# EAGLE design Artemis2 (EAGLE 5.07)
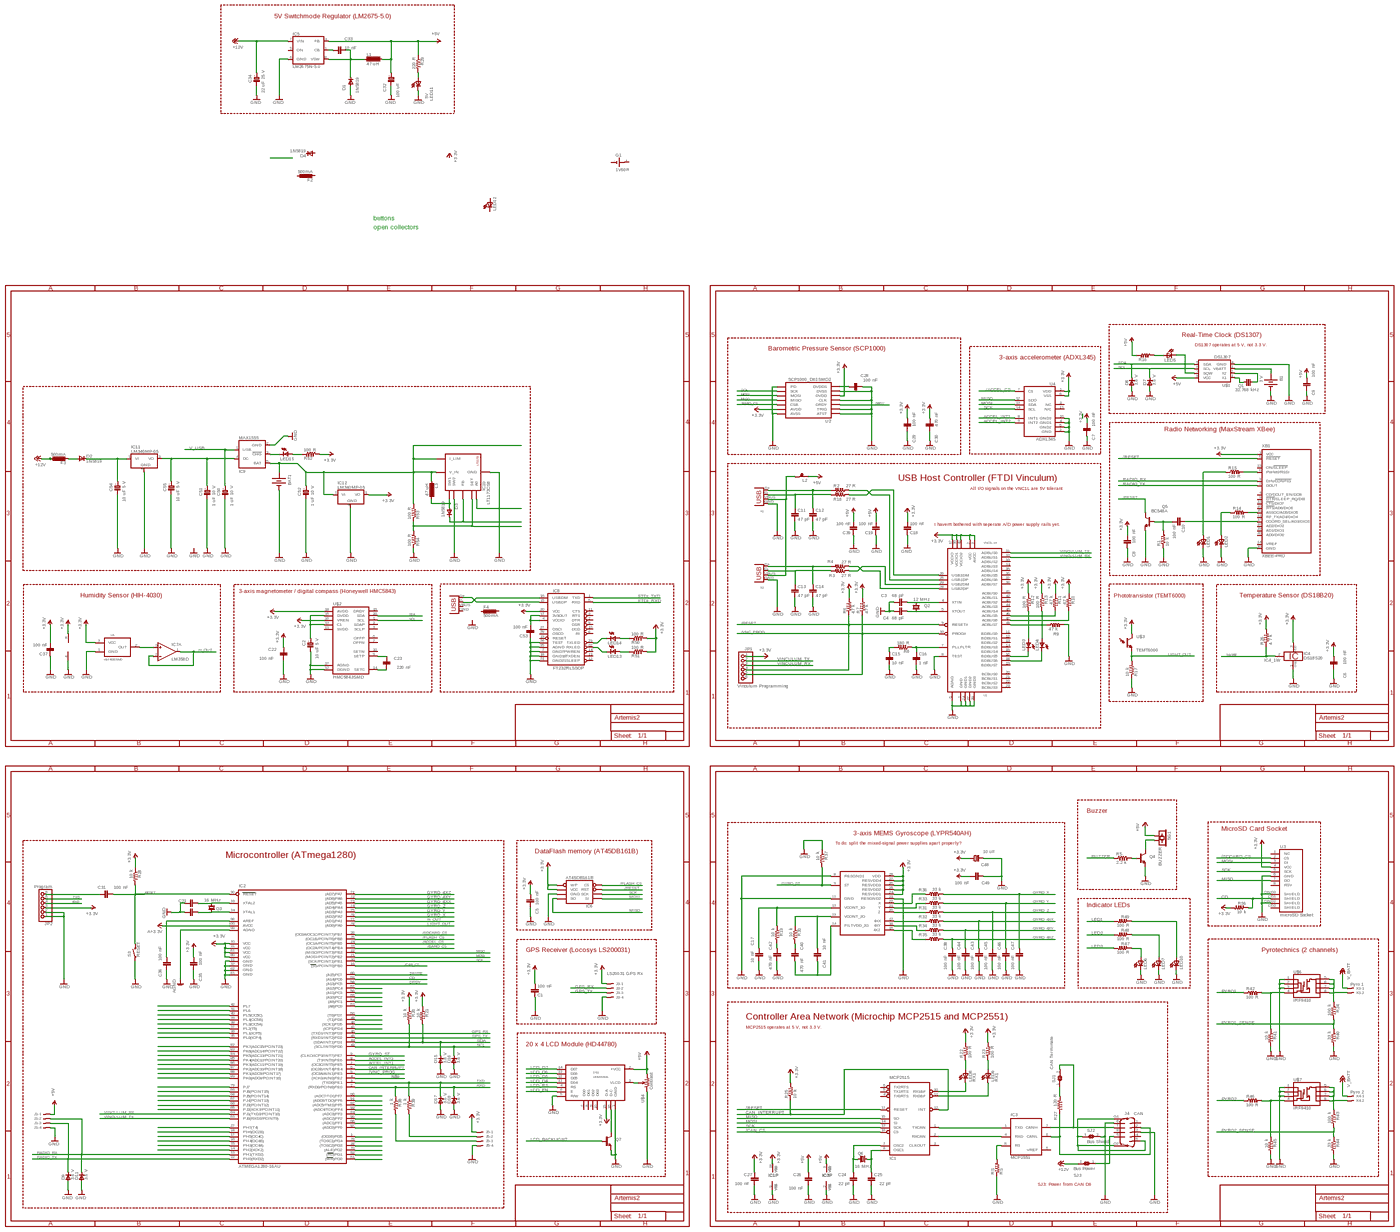
[diagram p0: schematic, sheet 1, overview]
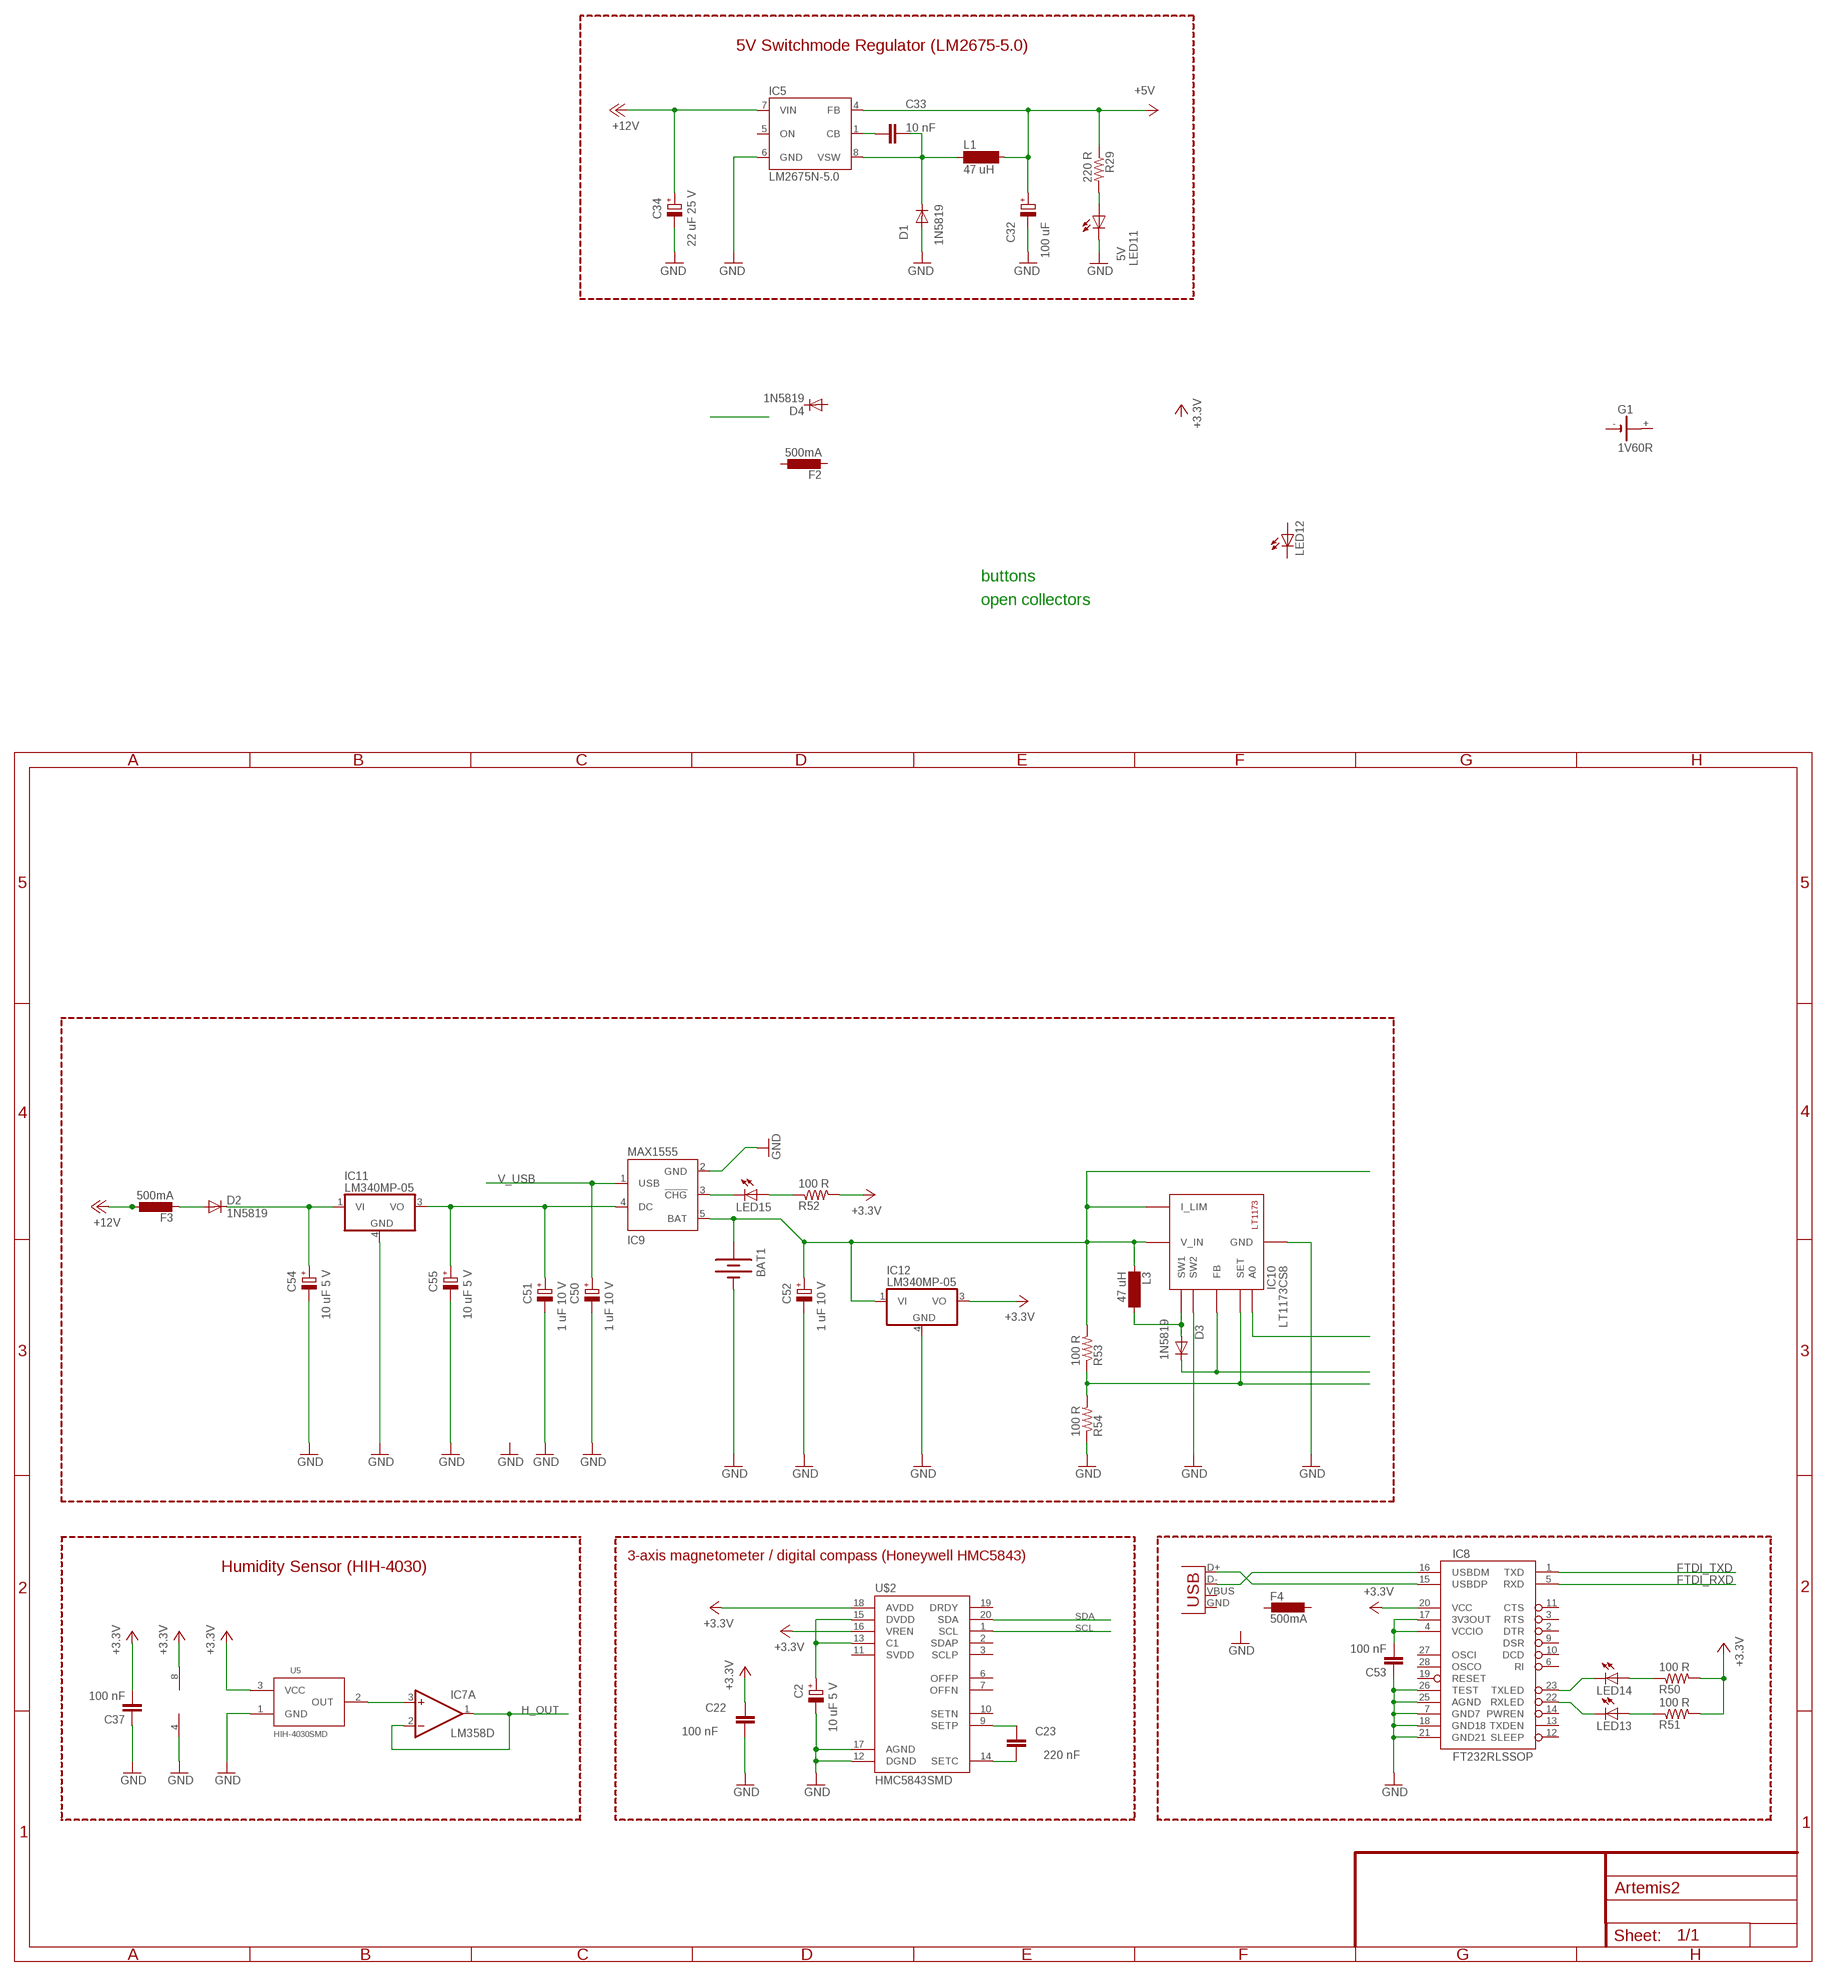
[diagram p1: schematic, sheet 1, part 1 of 4]
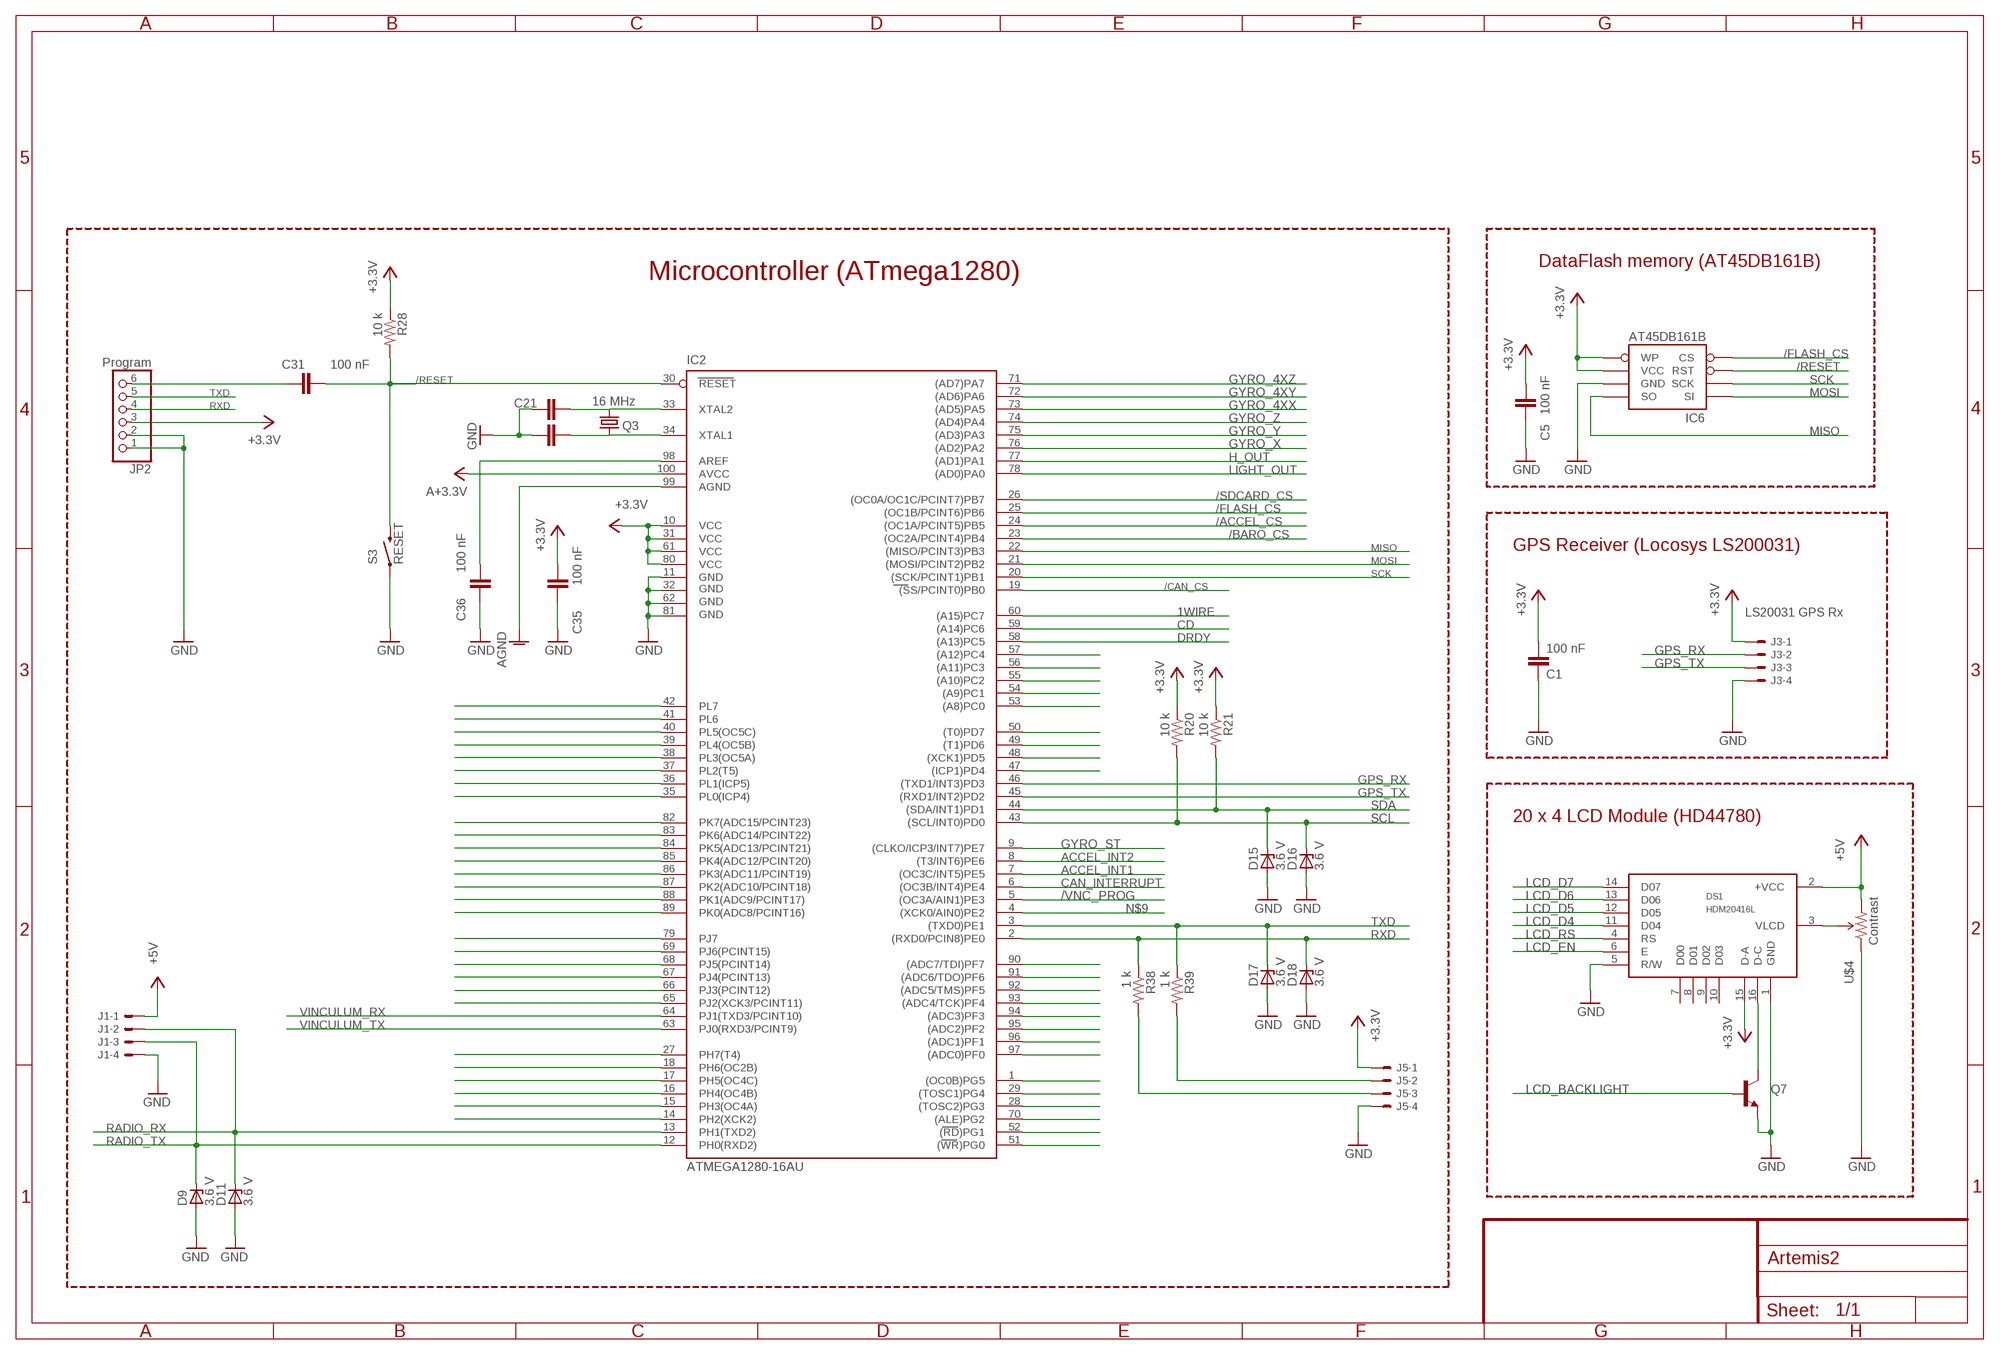
[diagram p2: schematic, sheet 1, part 2 of 4]
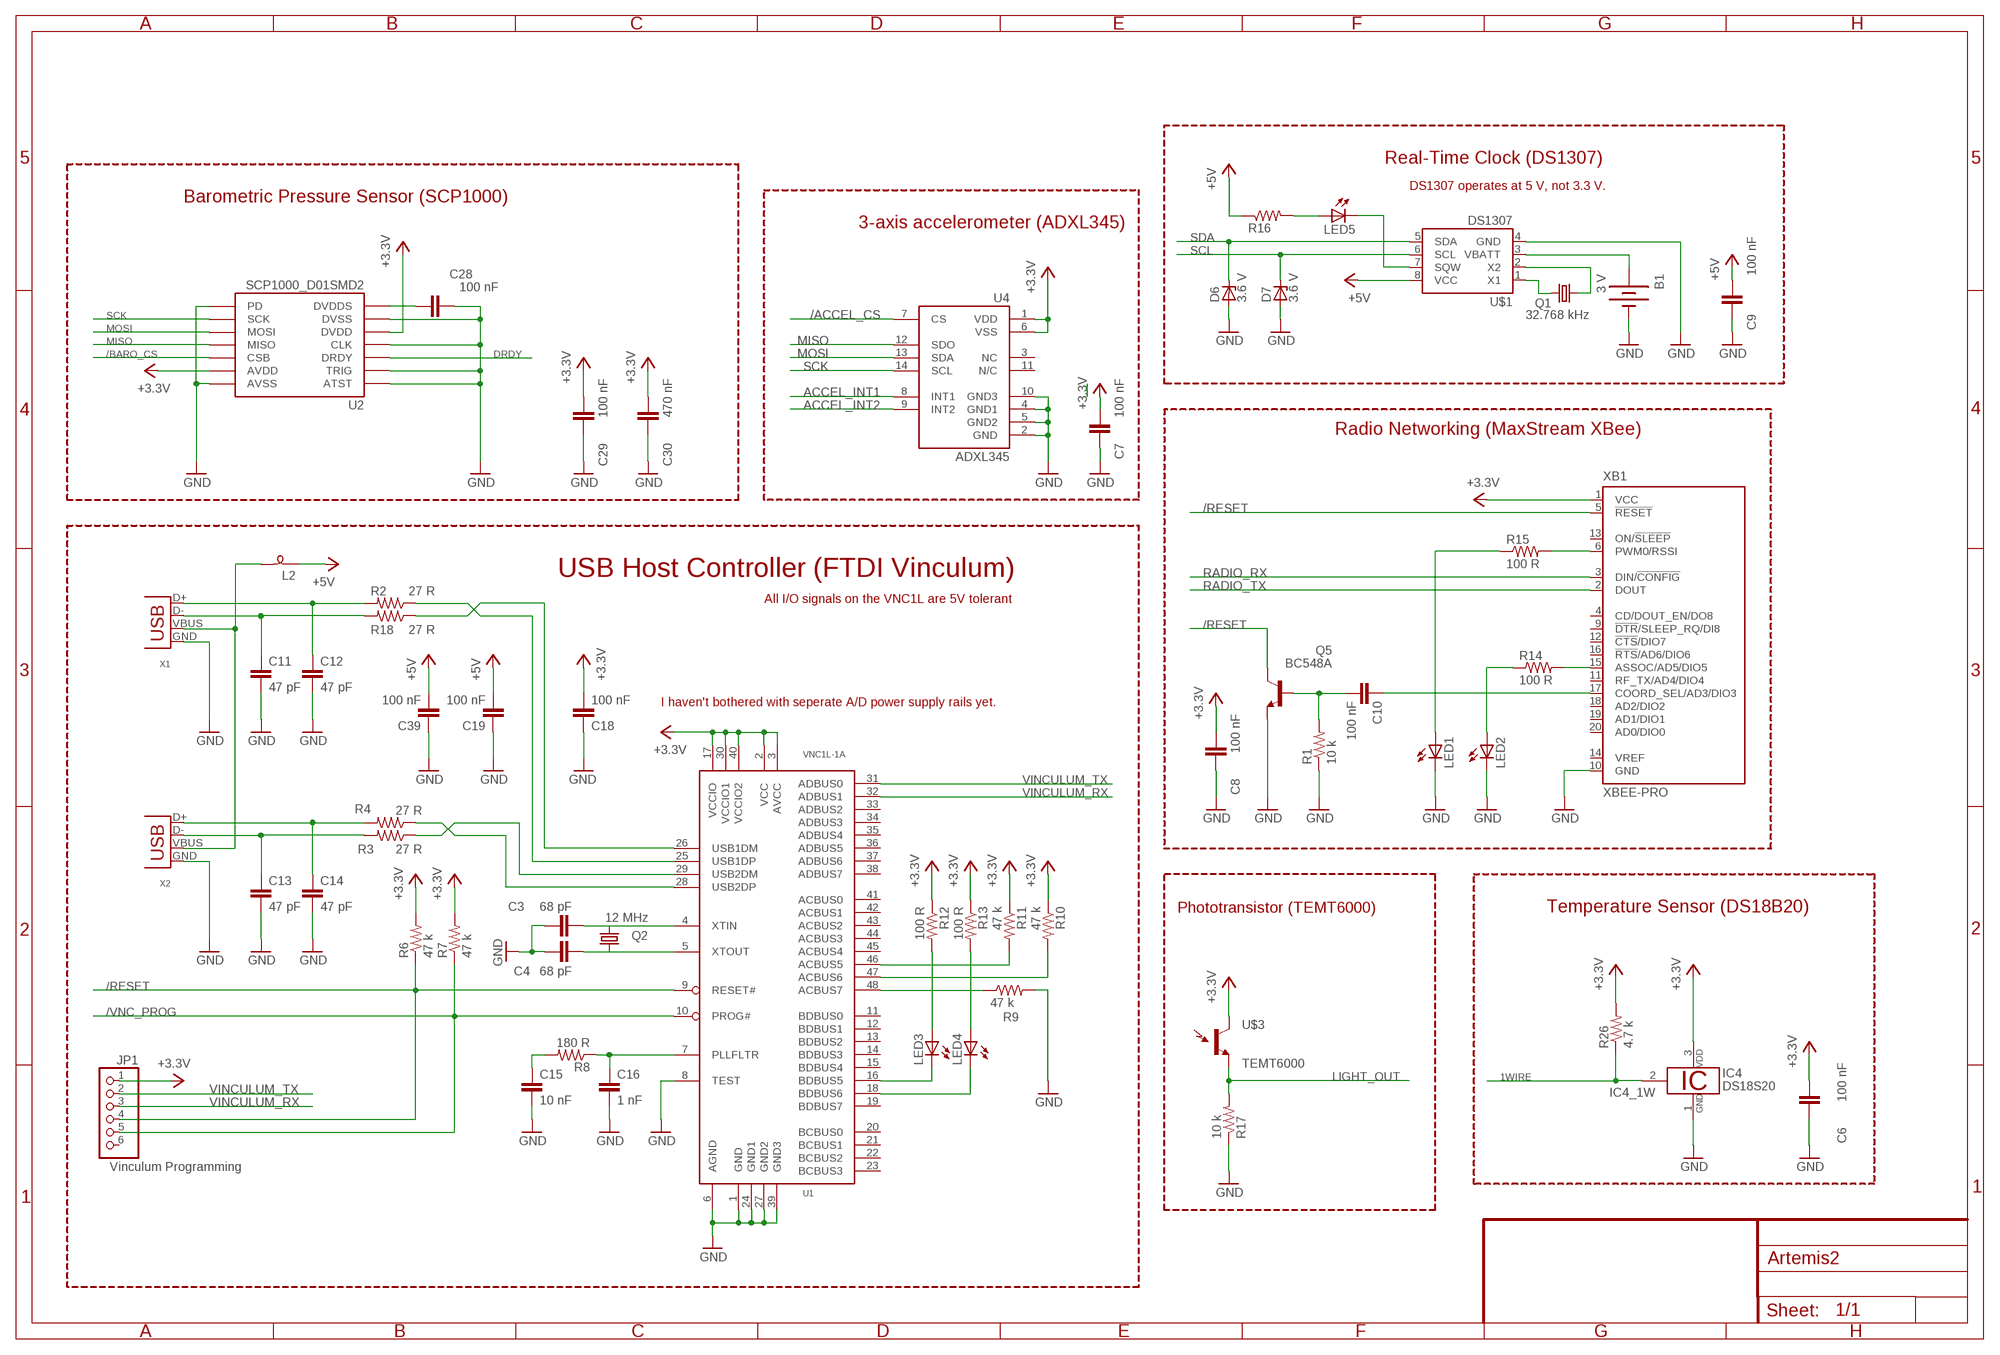
[diagram p3: schematic, sheet 1, part 3 of 4]
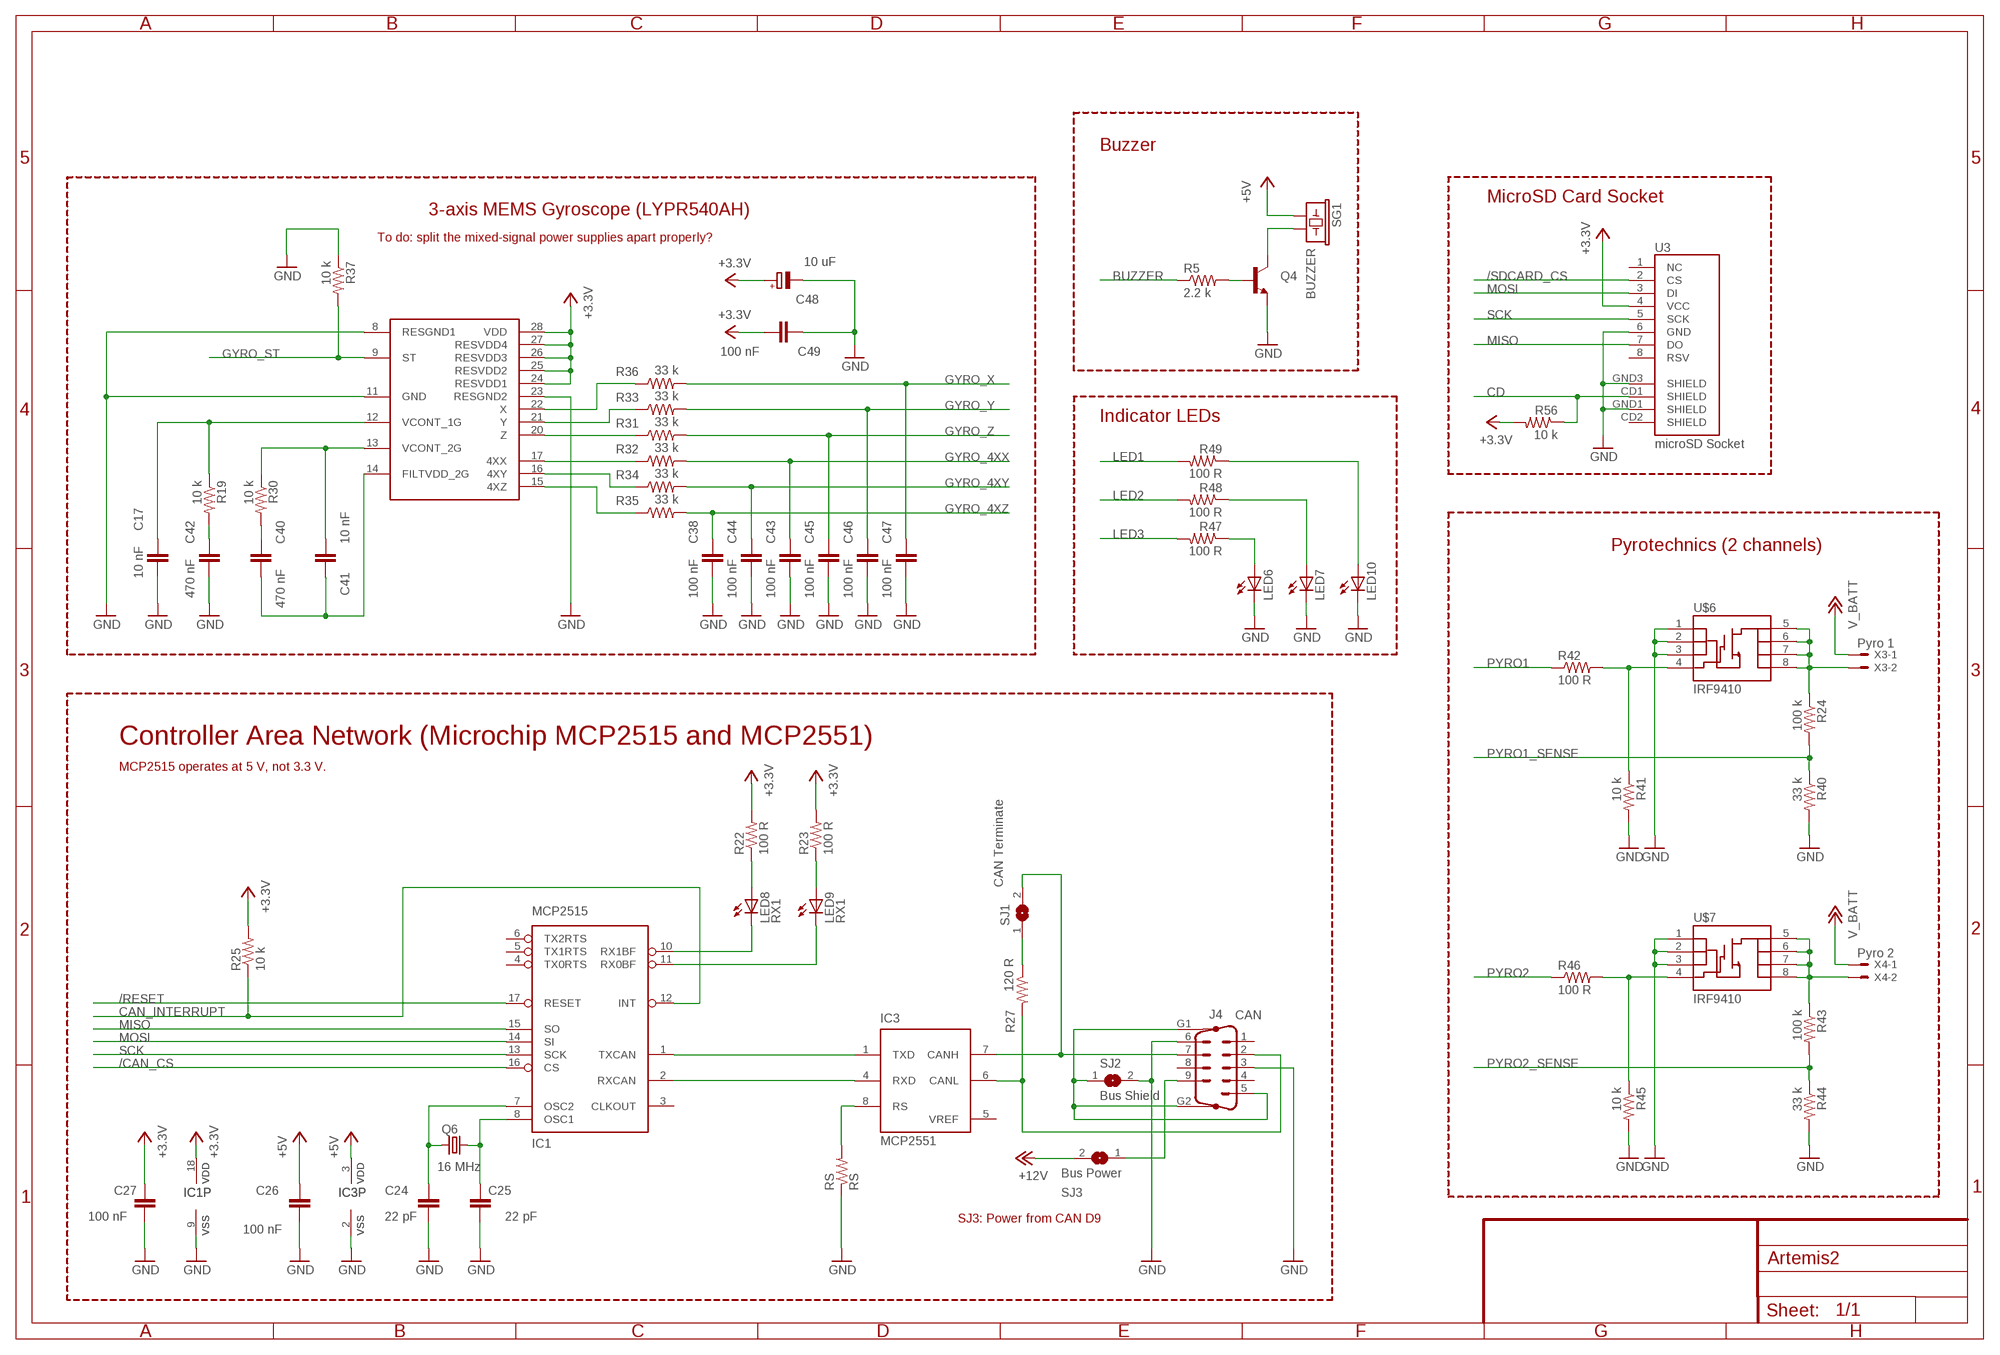
[diagram p4: schematic, sheet 1, part 4 of 4]

## Parts
B1  3 V  BATTERY12MM  [BATTCON_12MM]
BAT1  BATTERY1100  [LIPO-1100MAH]
C1  100 nF  C-EUC0805  [C0805]
C2  10 uF 5 V  CPOL-EUSMCD  [SMC_D]
C3  68 pF  C-EUC0805  [C0805]
C4  68 pF  C-EUC0805  [C0805]
C5  100 nF  C-EUC0805  [C0805]
C6  100 nF  C-EUC0805  [C0805]
C7  100 nF  C-EUC0805  [C0805]
C8  100 nF  C-EUC0805  [C0805]
C9  100 nF  C-EUC0805  [C0805]
C10  100 nF  C-EUC0805  [C0805]
C11  47 pF  C-EUC0805  [C0805]
C12  47 pF  C-EUC0805  [C0805]
C13  47 pF  C-EUC0805  [C0805]
C14  47 pF  C-EUC0805  [C0805]
C15  10 nF  C-EUC0805  [C0805]
C16  1 nF  C-EUC0805  [C0805]
C17  10 nF  C-EUC0805  [C0805]
C18  100 nF  C-EUC0805  [C0805]
C19  100 nF  C-EUC0805  [C0805]
C20  100 nF  C-EUC0805K  [C0805K]
C21  100 nF  C-EUC0805K  [C0805K]
C22  100 nF  C-EUC0805  [C0805]
C23  220 nF  C-EUC0805  [C0805]
C24  22 pF  C-EUC0805  [C0805]
C25  22 pF  C-EUC0805  [C0805]
C26  100 nF  C-EUC0805  [C0805]
C27  100 nF  C-EUC0805  [C0805]
C28  100 nF  C-EUC0805  [C0805]
C29  100 nF  C-EUC0805  [C0805]
C30  470 nF  C-EUC0805  [C0805]
C31  100 nF  C-EUC0805K  [C0805K]
C32  100 uF  CPOL-EUSMCD  [SMC_D]
C33  10 nF  C-EUC0805  [C0805]
C34  22 uF 25 V  CPOL-EUSMCD  [SMC_D]
C35  100 nF  C-EUC0805  [C0805]
C36  100 nF  C-EUC0805  [C0805]
C37  100 nF  C-EUC0805  [C0805]
C38  100 nF  C-EUC0805  [C0805]
C39  100 nF  C-EUC0805  [C0805]
C40  470 nF  C-EUC0805  [C0805]
C41  10 nF  C-EUC0805  [C0805]
C42  470 nF  C-EUC0805  [C0805]
C43  100 nF  C-EUC0805  [C0805]
C44  100 nF  C-EUC0805  [C0805]
C45  100 nF  C-EUC0805  [C0805]
C46  100 nF  C-EUC0805  [C0805]
C47  100 nF  C-EUC0805  [C0805]
C48  10 uF  CPOL-EUSMCD  [SMC_D]
C49  100 nF  C-EUC0805  [C0805]
C50  1 uF 10 V  CPOL-EUSMCD  [SMC_D]
C51  1 uF 10 V  CPOL-EUSMCD  [SMC_D]
C52  1 uF 10 V  CPOL-EUSMCD  [SMC_D]
C53  100 nF  C-EUC0805  [C0805]
C54  10 uF 5 V  CPOL-EUSMCD  [SMC_D]
C55  10 uF 5 V  CPOL-EUSMCD  [SMC_D]
D1  1N5819  DIODE-SOD123  [SOD123]
D2  1N5819  DIODE-SOD123  [SOD123]
D3  1N5819  DIODE-SOD123  [SOD123]
D4  1N5819  DIODE-SOD123  [SOD123]
D6  3.6 V  ZENER-DIODESOD80C  [SOD80C]
D7  3.6 V  ZENER-DIODESOD80C  [SOD80C]
D9  3.6 V  ZENER-DIODESOD80C  [SOD80C]
D11  3.6 V  ZENER-DIODESOD80C  [SOD80C]
D15  3.6 V  ZENER-DIODESOD80C  [SOD80C]
D16  3.6 V  ZENER-DIODESOD80C  [SOD80C]
D17  3.6 V  ZENER-DIODESOD80C  [SOD80C]
D18  3.6 V  ZENER-DIODESOD80C  [SOD80C]
DS1  HDM20416L  [HDM20416L]
F2  500mA  L-EUL1812  [L1812]
F3  500mA  L-EUL1812  [L1812]
F4  500mA  L-EUL1812  [L1812]
G1  1V60R  [1V60R]
IC1  MCP2515  MCP2510SO  [SO-18W]
IC2  ATMEGA1280-16AU  [TQFP100]
IC3  MCP2551  MCP2551SN  [SO-08]
IC4  DS18S20  [TO92-]
IC5  LM2675N-5.0  LM2675M  [SO08]
IC6  AT45DB161B  AT45DB041BWIDE  [SO08WIDE]
IC7  LM358D  [SO08]
IC8  FT232RLSSOP  [SSOP28DB]
IC9  MAX1555  [SOT23-5L]
IC10  LT1173CS8  [SOIC8]
IC11  LM340MP-05  [SOT223]
IC12  LM340MP-05  [SOT223]
J1  22-23-2041  [22-23-2041]
J3  LS20031 GPS Rx  22-23-2041  [22-23-2041]
J4  CAN  M09HP  [M09HP]
J5  22-23-2041  [22-23-2041]
JP1  Vinculum Programming  PINHD-1X6  [1X06]
JP2  Program  PINHD-1X6  [1X06]
L1  47 uH  MS50  [MS50]
L2  SM-B5  [SM-B5]
L3  47 uH  MS50  [MS50]
LED1  LEDCHIPLED_0805  [CHIPLED_0805]
LED2  LEDCHIPLED_0805  [CHIPLED_0805]
LED3  LEDCHIPLED_0805  [CHIPLED_0805]
LED4  LEDCHIPLED_0805  [CHIPLED_0805]
LED5  LEDCHIPLED_0805  [CHIPLED_0805]
LED6  LEDCHIPLED_0805  [CHIPLED_0805]
LED7  LEDCHIPLED_0805  [CHIPLED_0805]
LED8  RX1  LEDCHIP-LED0805  [CHIP-LED0805]
LED9  RX1  LEDCHIP-LED0805  [CHIP-LED0805]
LED10  LEDCHIPLED_0805  [CHIPLED_0805]
LED11  5V  LEDCHIP-LED0805  [CHIP-LED0805]
LED12  LEDCHIPLED_0805  [CHIPLED_0805]
LED13  LEDCHIPLED_0805  [CHIPLED_0805]
LED14  LEDCHIPLED_0805  [CHIPLED_0805]
LED15  LEDCHIPLED_0805  [CHIPLED_0805]
Q1  32.768 kHz  CRYSTALTC38H  [TC38H]
Q2  12 MHz  CRYSTALHC49S  [HC49/S]
Q3  16 MHz  CRYSTALHC49S  [HC49/S]
Q4  TRANSISTOR_NPNSOT23-3  [SOT23-3]
Q5  BC548A  [TO92-EBC]
Q6  16 MHz  CRYSTALHC49UP  [HC49UP]
Q7  TRANSISTOR_NPNSOT23-3  [SOT23-3]
R1  10 k  R-US_R0805  [R0805]
R2  27 R  R-US_R0805  [R0805]
R3  27 R  R-US_R0805  [R0805]
R4  27 R  R-US_R0805  [R0805]
R5  2.2 k  R-US_R0805  [R0805]
R6  47 k  R-US_R0805  [R0805]
R7  47 k  R-US_R0805  [R0805]
R8  180 R  R-US_R0805  [R0805]
R9  47 k  R-US_R0805  [R0805]
R10  47 k  R-US_R0805  [R0805]
R11  47 k  R-US_R0805  [R0805]
R12  100 R  R-US_R0805  [R0805]
R13  100 R  R-US_R0805  [R0805]
R14  100 R  R-US_R0805  [R0805]
R15  100 R  R-US_R0805  [R0805]
R16  R-US_R0805  [R0805]
R17  10 k  R-US_R0805  [R0805]
R18  27 R  R-US_R0805  [R0805]
R19  10 k  R-US_R0805  [R0805]
R20  10 k  R-US_R0805  [R0805]
R21  10 k  R-US_R0805  [R0805]
R22  100 R  R-US_M0805  [M0805]
R23  100 R  R-US_M0805  [M0805]
R24  100 k  R-US_R0805  [R0805]
R25  10 k  R-US_M0805  [M0805]
R26  4.7 k  R-US_M0805  [M0805]
R27  120 R  R-US_M0805  [M0805]
R28  10 k  R-US_R0805  [R0805]
R29  220 R  R-US_M0805  [M0805]
R30  10 k  R-US_R0805  [R0805]
R31  33 k  R-US_R0805  [R0805]
R32  33 k  R-US_R0805  [R0805]
R33  33 k  R-US_R0805  [R0805]
R34  33 k  R-US_R0805  [R0805]
R35  33 k  R-US_R0805  [R0805]
R36  33 k  R-US_R0805  [R0805]
R37  10 k  R-US_R0805  [R0805]
R38  1 k  R-US_R0805  [R0805]
R39  1 k  R-US_R0805  [R0805]
R40  33 k  R-US_R0805  [R0805]
R41  10 k  R-US_R0805  [R0805]
R42  100 R  R-US_R0805  [R0805]
R43  100 k  R-US_R0805  [R0805]
R44  33 k  R-US_R0805  [R0805]
R45  10 k  R-US_R0805  [R0805]
R46  100 R  R-US_R0805  [R0805]
R47  100 R  R-US_M0805  [M0805]
R48  100 R  R-US_M0805  [M0805]
R49  100 R  R-US_M0805  [M0805]
R50  100 R  R-US_M0805  [M0805]
R51  100 R  R-US_M0805  [M0805]
R52  100 R  R-US_M0805  [M0805]
R53  100 R  R-US_M0805  [M0805]
R54  100 R  R-US_M0805  [M0805]
R56  10 k  R-US_M0805  [M0805]
RS  RS  R-US_M0805  [M0805]
S3  RESET  SWITCH-MOMENTARY-2SMD  [TACTILE_SWITCH_SMD]
SG1  BUZZER  BUZZERSMD2  [BUZZER-CCV]
SJ1  CAN Terminate  SJ  [SJ]
SJ2  Bus Shield  SJ  [SJ]
SJ3  Bus Power  SJ  [SJ]
U1  VNC1L-1A  [LQFP48]
U2  SCP1000_D01SMD2  [SCP1000-LG]
U3  microSD Socket  USD-SOCKETNEW  [MICRO-SD-SOCKET-PP]
U4  ADXL345  [LGA14]
U5  HIH-4030SMD  [HIH-4030]
U$1  DS1307  DS1307SO8  [SO08]
U$2  HMC5843SMD  [LPCC20]
U$3  TEMT6000  [TEMT6000-SEN]
U$4  Contrast  TRIMPOTPTH  [TRIM_POT_PTH]
U$5  LYPR540AH  [LGA28L]
U$6  IRF9410  MOSFET-NCHANNEL-SOIC8  [SO08]
U$7  IRF9410  MOSFET-NCHANNEL-SOIC8  [SO08]
X1  USB-A-S  [USB-A-S]
X2  USB-A-S  [USB-A-S]
X3  Pyro 1  22-23-2021  [22-23-2021]
X4  Pyro 2  22-23-2021  [22-23-2021]
X6  USBSMD  [USB-MINIB]
XB1  XBEE-PRO  [XBEE-PRO]

## Nets
1WIRE: IC2.60((A15)PC7) IC4.2 R26.1
+3V3: C1.2 C5.2 C6.2 C7.2 C8.2 C18.2 C22.2 C27.2 C29.2 C30.2 C35.2 C37.2 C48.+ C49.2 DS1.15(D-A) IC1.18(VDD) IC2.10(VCC) IC2.31(VCC1) IC2.61(VCC2) IC2.80(VCC3) IC4.3 IC6.5(WP) IC6.6(VCC) IC7.8(P:V+) IC8.20(VCC) IC12.3(VO) J3.1 J5.1 JP1.1 JP2.3 R6.2 R7.2 R10.1 R11.1 R12.1 R13.1 R20.1 R21.1 R22.2 R23.2 R25.2 R26.2 R28.1 R50.2 R51.2 R52.2 R56.2 U1.2(VCC) U1.3(AVCC) U1.17(VCCIO) U1.30(VCCIO1) U1.40(VCCIO2) U2.AVDD U2.DVDD U3.4(VCC) U4.1(VDD) U4.6(VSS) U5.3(VCC) U$2.16(VREN) U$2.18(AVDD) U$3.COLLECTOR(C1) U$5.24(RESVDD1) U$5.25(RESVDD2) U$5.26(RESVDD3) U$5.27(RESVDD4) U$5.28(VDD) XB1.1(VCC) ; supply symbol labelled +3.3V
+5V: C9.2 C19.2 C26.2 C32.+ C39.2 DS1.2(+VCC) IC3.3(VDD) IC5.4(FB) J1.1 L1.2 L2.1 R16.1 R29.1 SG1.+ U$1.8(VCC) U$4.3(CW)
+12V: C34.+ F3.1 IC5.7(VIN) SJ3.2
/ACCEL_CS: IC2.24((OC1A/PCINT5)PB5) U4.7(CS)
/BARO_CS: IC2.23((OC2A/PCINT4)PB4) U2.CSB
/CAN_CS: IC1.16(CS) IC2.19((SS/PCINT0)PB0)
/FLASH_CS: IC2.25((OC1B/PCINT6)PB6) IC6.4(CS)
/RESET: C31.2 IC1.17(RESET) IC2.30(RESET) IC6.3(RST) JP1.4 Q5.C R6.1 R28.2 S3.3 U1.9(RESET#) XB1.5(!RESET)
/SDCARD_CS: IC2.26((OC0A/OC1C/PCINT7)PB7) U3.2(CS)
/VNC_PROG: IC2.5((OC3A/AIN1)PE3) JP1.5 R7.1 U1.10(PROG#)
ACCEL_INT1: IC2.7((OC3C/INT5)PE5) U4.8(INT1)
ACCEL_INT2: IC2.8((T3/INT6)PE6) U4.9(INT2)
AGND: IC2.99(AGND)
BUZZER: R5.1
CAN_INTERRUPT: IC1.12(INT) IC2.6((OC3B/INT4)PE4) R25.1
CD: IC2.59((A14)PC6) U3.CD1(SHIELD)
DRDY: IC2.58((A13)PC5) U2.DRDY
FTDI_RXD: IC8.5(RXD)
FTDI_TXD: IC8.1(TXD)
GND: B1.GND(-) BAT1.- C1.1 C2.- C3.2 C4.2 C5.1 C6.1 C7.1 C8.1 C9.1 C11.2 C12.2 C13.2 C14.2 C15.2 C16.2 C17.1 C18.1 C19.1 C20.1 C21.1 C22.1 C24.1 C25.1 C26.1 C27.1 C28.1 C29.1 C30.1 C32.- C34.- C35.1 C36.1 C37.1 C38.1 C39.1 C42.1 C43.1 C44.1 C45.1 C46.1 C47.1 C48.- C49.1 C50.- C51.- C52.- C53.1 C54.- C55.- D1.A D6.A D7.A D9.A D11.A D15.A D16.A D17.A D18.A DS1.1(GND) DS1.5(R/W) IC1.9(VSS) IC2.11(GND) IC2.32(GND1) IC2.62(GND2) IC2.81(GND3) IC3.2(VSS) IC4.1 IC5.6(GND) IC6.7(GND) IC7.4(P:V-) IC8.7(GND7) IC8.18(GND18) IC8.21(GND21) IC8.25(AGND) IC8.26(TEST) IC9.2(GND) IC10.4(SW2) IC10.5(GND) IC11.4(GND) IC12.4(GND) J1.4 J3.4 J4.3 J4.6 J5.4 JP2.1 JP2.2 LED1.C LED2.C LED6.C LED7.C LED10.C LED11.C Q4.2(E) Q5.E Q7.2(E) R1.1 R9.2 R17.1 R37.1 R40.2 R41.2 R44.2 R45.2 R54.1 RS.1 S3.1 SJ2.2 U1.1(GND) U1.6(AGND) U1.8(TEST) U1.24(GND1) U1.27(GND2) U1.39(GND3) U2.ATST U2.AVSS U2.CLK U2.DVSS U2.PD U2.TRIG U3.6(GND) U3.GND1(SHIELD) U3.GND3(SHIELD) U4.2(GND) U4.4(GND1) U4.5(GND2) U4.10(GND3) U5.1(GND) U$1.4(GND) U$2.12(DGND) U$2.17(AGND) U$4.1(CCW) U$5.8(RESGND1) U$5.11(GND) U$5.23(RESGND2) U$6.1(S) U$6.2(S) U$6.3(S) U$7.1(S) U$7.2(S) U$7.3(S) X1.GND X2.GND XB1.10(GND)
GPS_RX: IC2.46((TXD1/INT3)PD3) J3.2
GPS_TX: IC2.45((RXD1/INT2)PD2) J3.3
GYRO_4XX: C43.2 IC2.73((AD5)PA5) R32.2
GYRO_4XY: C44.2 IC2.72((AD6)PA6) R34.2
GYRO_4XZ: C38.2 IC2.71((AD7)PA7) R35.2
GYRO_ST: IC2.9((CLKO/ICP3/INT7)PE7) R37.2 U$5.9(ST)
GYRO_X: C47.2 IC2.76((AD2)PA2) R36.2
GYRO_Y: C46.2 IC2.75((AD3)PA3) R33.2
GYRO_Z: C45.2 IC2.74((AD4)PA4) R31.2
H_OUT: IC2.77((AD1)PA1) IC7.1(A:OUT) IC7.2(A:-IN)
LCD_BACKLIGHT: Q7.1(B)
LCD_D4: DS1.11(D04)
LCD_D5: DS1.12(D05)
LCD_D6: DS1.13(D06)
LCD_D7: DS1.14(D07)
LCD_EN: DS1.6(E)
LCD_RS: DS1.4(RS)
LED1: R49.2
LED2: R48.2
LED3: R47.2
LIGHT_OUT: IC2.78((AD0)PA0) R17.2 U$3.EMITTER(E1)
MISO: IC1.15(SO) IC2.22((MISO/PCINT3)PB3) IC6.8(SO) U2.MISO U3.7(DO) U4.12(SDO)
MOSI: IC1.14(SI) IC2.21((MOSI/PCINT2)PB2) IC6.1(SI) U2.MOSI/SDA(MOSI) U3.3(DI) U4.13(SDA)
N$1: IC2.47((ICP1)PD4)
N$2: C11.1 R18.2 X1.D-
N$3: R14.2 XB1.15(ASSOC/AD5/DIO5)
N$4: C12.1 R2.2 X1.D+
N$5: C10.2 Q5.B R1.2
N$6: R15.2 XB1.6(PWM0/RSSI)
N$7: C20.2 IC2.33(XTAL2) Q3.2
N$8: C21.2 IC2.34(XTAL1) Q3.1
N$9: IC2.4((XCK0/AIN0)PE2)
N$10: C2.+ U$2.13(C1) U$2.15(DVDD)
N$11: R56.1
N$12: IC2.48((XCK1)PD5)
N$13: LED2.A R14.1
N$14: C17.2 R19.1 U$5.12(VCONT_1G)
N$15: C36.2 IC2.98(AREF)
N$16: R36.1 U$5.22(X)
N$17: R31.1 U$5.20(Z)
N$18: C13.1 R3.2 X2.D-
N$19: C14.1 R4.2 X2.D+
N$20: LED5.C U$1.7(SQW)
N$21: LED5.A R16.2
N$22: R3.1 U1.29(USB2DM)
N$23: IC7.3(A:+IN) U5.2(OUT)
N$24: R4.1 U1.28(USB2DP)
N$25: R2.1 U1.25(USB1DP)
N$26: R18.1 U1.26(USB1DM)
N$27: R33.1 U$5.21(Y)
N$28: R32.1 U$5.17(4XX)
N$29: R34.1 U$5.16(4XY)
N$30: R35.1 U$5.15(4XZ)
N$31: J5.3 R38.2
N$32: C42.2 R19.2
N$33: C28.2 U2.DVDDS
N$34: C23.1 U$2.14(SETC)
N$35: B1.PWR@1(+) U$1.3(VBATT)
N$36: Q1.2 U$1.1(X1)
N$37: Q1.1 U$1.2(X2)
N$38: R11.2 U1.46(ACBUS5)
N$39: C23.2 U$2.9(SETP)
N$40: J5.2 R39.2
N$41: IC2.49((T1)PD6)
N$42: IC2.50((T0)PD7)
N$43: C40.1 C41.1 U$5.14(FILTVDD_2G)
N$44: C3.1 Q2.2 U1.4(XTIN)
N$45: C4.1 Q2.1 U1.5(XTOUT)
N$46: R9.1 U1.48(ACBUS7)
N$47: R10.2 U1.47(ACBUS6)
N$48: LED4.C U1.18(BDBUS6)
N$49: LED3.A R12.2
N$50: LED4.A R13.2
N$51: LED3.C U1.16(BDBUS5)
N$52: C40.2 R30.2
N$53: C41.2 R30.1 U$5.13(VCONT_2G)
N$54: IC2.53((A8)PC0)
N$55: LED1.A R15.1
N$56: IC2.54((A9)PC1)
N$57: IC2.55((A10)PC2)
N$58: IC2.56((A11)PC3)
N$59: C10.1 XB1.17(COORD_SEL/AD3/DIO3)
N$60: IC2.57((A12)PC4)
N$61: IC2.90((ADC7/TDI)PF7)
N$62: IC2.51((WR)PG0)
N$63: IC2.52((RD)PG1)
N$64: IC2.70((ALE)PG2)
N$65: IC2.28((TOSC2)PG3)
N$66: IC2.29((TOSC1)PG4)
N$67: IC2.1((OC0B)PG5)
N$68: IC2.97((ADC0)PF0)
N$69: IC2.96((ADC1)PF1)
N$70: IC2.95((ADC2)PF2)
N$71: IC2.94((ADC3)PF3)
N$72: IC2.93((ADC4/TCK)PF4)
N$73: IC2.92((ADC5/TMS)PF5)
N$74: IC2.91((ADC6/TDO)PF6)
N$75: IC2.14(PH2(XCK2))
N$76: IC2.15(PH3(OC4A))
N$77: IC1.1(TXCAN) IC3.1(TXD)
N$78: IC1.2(RXCAN) IC3.4(RXD)
N$79: IC2.27(PH7(T4))
N$80: IC2.18(PH6(OC2B))
N$81: IC2.17(PH5(OC4C))
N$82: IC2.16(PH4(OC4B))
N$83: IC2.65(PJ2(XCK3/PCINT11))
N$84: IC2.66(PJ3(PCINT12))
N$85: C25.2 IC1.8(OSC1) Q6.1
N$86: C15.1 R8.2
N$87: C16.1 R8.1 U1.7(PLLFLTR)
N$88: C24.2 IC1.7(OSC2) Q6.2
N$89: IC1.11(RX0BF) LED9.C
N$90: IC1.10(RX1BF) LED8.C
N$91: LED9.A R23.1
N$92: LED8.A R22.1
N$93: IC3.8(RS) RS.2
N$94: IC3.7(CANH) J4.7 SJ1.2
N$95: IC3.6(CANL) J4.2 R27.2
N$96: IC2.67(PJ4(PCINT13))
N$97: IC2.68(PJ5(PCINT14))
N$98: C31.1 JP2.6
N$99: C33.1 D1.C IC5.8(VSW) L1.1
N$100: C33.2 IC5.1(CB)
N$101: J4.5 J4.G1 J4.G2 SJ2.1
N$102: IC2.69(PJ6(PCINT15))
N$103: IC2.79(PJ7)
N$104: LED11.A R29.2
N$105: IC2.82(PK7(ADC15/PCINT23))
N$106: IC2.83(PK6(ADC14/PCINT22))
N$107: IC2.84(PK5(ADC13/PCINT21))
N$108: IC2.85(PK4(ADC12/PCINT20))
N$109: IC2.86(PK3(ADC11/PCINT19))
N$110: IC2.87(PK2(ADC10/PCINT18))
N$111: J4.9 SJ3.1
N$113: IC2.88(PK1(ADC9/PCINT17))
N$114: IC2.89(PK0(ADC8/PCINT16))
N$115: IC2.35(PL0(ICP4))
N$116: IC2.36(PL1(ICP5))
N$117: IC2.37(PL2(T5))
N$118: IC2.38(PL3(OC5A))
N$119: IC2.39(PL4(OC5B))
N$120: IC2.40(PL5(OC5C))
N$121: IC2.41(PL6)
N$122: IC2.42(PL7)
N$123: R27.1 SJ1.1
N$125: L2.2 X1.VBUS X2.VBUS
N$126: R43.1 U$7.5(D) U$7.6(D) U$7.7(D) U$7.8(D) X4.2
N$127: IC8.16(USBDM) X6.D-
N$128: C51.+ C55.+ IC9.4(DC) IC11.3(VO)
N$129: R45.1 R46.2 U$7.4(G)
N$130: R24.1 U$6.5(D) U$6.6(D) U$6.7(D) U$6.8(D) X3.2
N$132: R41.1 R42.2 U$6.4(G)
N$133: IC8.15(USBDP) X6.D+
N$134: Q4.3(C) SG1.-
N$135: DS1.3(VLCD) U$4.2(WIPER)
N$136: DS1.16(D-C) Q7.3(C)
N$137: Q4.1(B) R5.2
N$140: LED6.A R47.1
N$141: LED7.A R48.1
N$142: LED10.A R49.1
N$143: IC8.23(TXLED) LED14.C
N$144: C53.2 IC8.4(VCCIO) IC8.17(3V3OUT)
N$146: C54.+ D2.C IC11.1(VI)
N$147: IC10.6(A0)
N$149: IC9.3(!CHG) LED15.C
N$150: LED15.A R52.1
N$151: IC8.22(RXLED) LED13.C
N$152: LED13.A R51.1
N$154: LED14.A R50.1
N$155: D3.C IC10.8(FB)
N$156: D2.A
N$157: IC10.7(SET) R53.1 R54.2
N$158: D3.A IC10.3(SW1) L3.2
PYRO1: R42.1
PYRO1_SENSE: R24.2 R40.1
PYRO2: R46.1
PYRO2_SENSE: R43.2 R44.1
RADIO_RX: D11.C IC2.13(PH1(TXD2)) J1.2 XB1.3(DIN/!CONFIG)
RADIO_TX: D9.C IC2.12(PH0(RXD2)) J1.3 XB1.2(DOUT)
RXD: D18.C IC2.2((RXD0/PCIN8)PE0) JP2.4 R38.1
SCK: IC1.13(SCK) IC2.20((SCK/PCINT1)PB1) IC6.2(SCK) U2.SCK/SCL(SCK) U3.5(SCK) U4.14(SCL)
SCL: D7.C D16.C IC2.43((SCL/INT0)PD0) R20.2 U$1.6(SCL) U$2.1(SCL)
SDA: D6.C D15.C IC2.44((SDA/INT1)PD1) R21.2 U$1.5(SDA) U$2.20(SDA)
TXD: D17.C IC2.3((TXD0)PE1) JP2.5 R39.1
V_BATT: BAT1.+ C52.+ IC9.5(BAT) IC10.1(I_LIM) IC10.2(V_IN) IC12.1(VI) L3.1 R53.2 X3.1 X4.1
V_USB: C50.+ IC9.1(USB)
VCCIO: IC2.100(AVCC) ; supply symbol labelled A+3.3V
VINCULUM_RX: IC2.64(PJ1(TXD3/PCINT10)) JP1.3 U1.32(ADBUS1)
VINCULUM_TX: IC2.63(PJ0(RXD3/PCINT9)) JP1.2 U1.31(ADBUS0)
Unconnected: D4.A D4.C DS1.7(D00) DS1.8(D01) DS1.9(D02) DS1.10(D03) F2.1 F2.2 F3.2 F4.1 F4.2 G1.+ G1.+@1(+) G1.- IC1.3(CLKOUT) IC1.4(TX0RTS) IC1.5(TX1RTS) IC1.6(TX2RTS) IC5.5(ON) IC7.5(B:+IN) IC7.6(B:-IN) IC7.7(B:OUT) IC8.2(DTR) IC8.3(RTS) IC8.6(RI) IC8.9(DSR) IC8.10(DCD) IC8.11(CTS) IC8.12(SLEEP) IC8.13(TXDEN) IC8.14(PWREN) IC8.19(RESET) IC8.27(OSCI) IC8.28(OSCO) J4.1 J4.4 J4.8 JP1.6 LED12.A LED12.C U1.11(BDBUS0) U1.12(BDBUS1) U1.13(BDBUS2) U1.14(BDBUS3) U1.15(BDBUS4) U1.19(BDBUS7) U1.20(BCBUS0) U1.21(BCBUS1) U1.22(BCBUS2) U1.23(BCBUS3) U1.33(ADBUS2) U1.34(ADBUS3) U1.35(ADBUS4) U1.36(ADBUS5) U1.37(ADBUS6) U1.38(ADBUS7) U1.41(ACBUS0) U1.42(ACBUS1) U1.43(ACBUS2) U1.44(ACBUS3) U1.45(ACBUS4) U3.1(NC) U3.8(RSV) U3.CD2(SHIELD) U4.3(NC) U4.11(N/C) U$2.2(SDAP) U$2.3(SCLP) U$2.6(OFFP) U$2.7(OFFN) U$2.10(SETN) U$2.11(SVDD) U$2.19(DRDY) X6.GND X6.VBUS XB1.4(CD/DOUT_EN/DO8) XB1.9(!DTR!/SLEEP_RQ/DI8) XB1.11(RF_TX/AD4/DIO4) XB1.12(!CTS!/DIO7) XB1.13(ON/!SLEEP) XB1.14(VREF) XB1.16(!RTS!/AD6/DIO6) XB1.18(AD2/DIO2) XB1.19(AD1/DIO1) XB1.20(AD0/DIO0)

## Notes on the sheet
- 5V Switchmode Regulator (LM2675-5.0)
- buttons
- open collectors
- Real-Time Clock (DS1307)
- DS1307 operates at 5 V, not 3.3 V.
- Barometric Pressure Sensor (SCP1000)
- 3-axis accelerometer (ADXL345)
- Radio Networking (MaxStream XBee)
- USB Host Controller (FTDI Vinculum)
- All I/O signals on the VNC1L are 5V tolerant
- I haven't bothered with seperate A/D power supply rails yet.
- 3-axis magnetometer / digital compass (Honeywell HMC5843)
- Humidity Sensor (HIH-4030) | Phototransistor (TEMT6000) | Temperature Sensor (DS18B20)
- Buzzer
- MicroSD Card Socket
- 3-axis MEMS Gyroscope (LYPR540AH)
- To do: split the mixed-signal power supplies apart properly?
- DataFlash memory (AT45DB161B)
- Microcontroller (ATmega1280)
- Indicator LEDs
- GPS Receiver (Locosys LS200031) | Pyrotechnics (2 channels)
- Controller Area Network (Microchip MCP2515 and MCP2551)
- MCP2515 operates at 5 V, not 3.3 V.
- 20 x 4 LCD Module (HD44780)
- SJ3: Power from CAN D9

## Power pins joined to a net without a drawn wire
VREF: IC3.5(VREF)

## Library data of the parts
B1 BAT1 = SparkFun:BATTERY: Battery Holders Various common sizes : AA, AAA, 20mm coin cell and 12mm coin cell.
C1 C3-C19 C22-C30 C33 C35-C47 C49 C53 = rcl:C-EU: CAPACITOR, European symbol
C2 C32 C34 C48 C50-C52 C54 C55 = resistor:CPOL-EU: POLARIZED CAPACITOR, European symbol
C20 C21 C31 = resistor:C-EU: CAPACITOR, European symbol
D1-D4 = diode:DIODE-: DIODE
D6 D7 D9 D11 D15-D18 = diode:ZENER-DIODE: Z-Diode
DS1 = abi-lcd:HDM20416L
F2-F4 = rcl:L-EU: INDUCTOR, European symbol
G1 = battery:1V60R: NC ACCU Varta
IC1 = microchip_can:MCP2510
IC2 = atmel-2005:ATMEGA*: MICROCONTROLLER 64/128/256 Kbytes FLASH 4 Kbytes EEPROM 8 Kbytes SRAM 86 General Purpose I/O pins 12-channels16-bit PWM 4 x Serial USARTs 16-channels 10-bit A/D
IC3 = microchip_can:MCP2551: High Speed CAN tranceiver
IC4 = 1wire:DS18S20: High Precision Digital Thermometer This chip provides a onewire thermosensor with approx. 0.5°C accuracy.A programmable over/undertemperure alarm is available. Notes: Vdd must be applied for accurate measurements at low temperatures, as the parasite power circuit otherwise heats the sensor. If parasite power is used, Vdd has to be connected to GND. The DS1822 is a low-cost thermometer chip, the DS18B20 is similar to the DS18S20, but with 9..12 Bit programmable precision. Author: Jan Kandziora <jjj@gmx.de>
IC5 = v-reg-3:LM2675: National Semiconductor <http://www.national.com> 1.0A "Simple Switcher"(c) 260kHz, Vout 1.2-37V, Vin 40V, 250mOhm DMOS switch, 50µA standby current
IC6 = SparkFun:AT45DB041B
IC7 = linear:LM358: OP AMP also LM158; LM258; LM2904 Source: http://cache.national.com/ds/LM/LM158.pdf
IC8 = SparkFun:FT232RL: USB UART FT232RL 4th Generation USB UART (USB <-> Serial) Controller. Spark Fun Electronics SKU : COM-00650
IC9 = maxim:MAX1555: Dual-Input USB/AC Adapter 1-Cell Li+ Battery Chargers Source: http://www.maxim-ic.com .. MAX1551-MAX1555.pdf
IC10 = ltc_swr:LT1173: LT1173 - Micropower DC/DC Converter Adjustable and Fixed 5V, 12V Operates at Supply Voltages From 2.0V to 30V Consumes Only 110µA Supply Current Works in Step-Up or Step-Down Mode Only Three External Components Required Low Battery Detector Comparator On-Chip User-Adjustable Current Limit Internal 1A Power Switch Fixed or Adjustable Output Voltage Versions Space Saving 8-Pin MiniDIP or SO8 Package
IC11 IC12 = linear:LM340?-*: Positive VOLTAGE REGULATOR Source: http://cache.national.com/ds/LM/LM340.pdf
J1 J3 J5 = con-molex:22-23-2041: .100" (2.54mm) Center Header - 4 Pin
J4 = con-subd:M09HP: SUB-D
JP1 JP2 = pinhead:PINHD-1X6: PIN HEADER
L1 L3 = inductor-neosid:MS50: INDUCTOR SMD power inductor
L2 = inductor-neosid:SM-B: INDUCTOR SMD Bead inductor
LED1-LED15 = led:LED: LED OSRAM: - CHIPLED LG R971, LG N971, LY N971, LG Q971, LY Q971, LO R971, LY R971 LH N974, LH R974 LS Q976, LO Q976, LY Q976 LO Q996 - Hyper CHIPLED LW Q18S LB Q993, LB Q99A, LB R99A - SideLED LS A670, LO A670, LY A670, LG A670, LP A670 LB A673, LV A673, LT A673, LW A673 LH A674 LY A675 LS A676, LA A676, LO A676, LY A676, LW A676 LS A679, LY A679, LG A679 - Hyper Micro SIDELED® LS Y876, LA Y876, LO Y876, LY Y876 LT Y87S - SmartLED LW L88C, LW L88S LB L89C, LB L89S, LG L890 LS L89K, LO L89K, LY L89K LS L896, LA L896, LO L896, LY L896 - TOPLED LS T670, LO T670, LY T670, LG T670, LP T670 LSG T670, LSP T670, LSY T670, LOP T670, LYG T670 LG T671, LOG T671, LSG T671 LB T673, LV T673, LT T673, LW T673 LH T674 LS T676, LA T676, LO T676, LY T676, LB T676, LH T676, LSB T676, LW T676 LB T67C, LV T67C, LT T67C, LS T67K, LO T67K, LY T67K, LW E67C LS E67B, LA E67B, LO E67B, LY E67B, LB E67C, LV E67C, LT E67C LW T67C LS T679, LY T679, LG T679 LS T770, LO T770, LY T770, LG T770, LP T770 LB T773, LV T773, LT T773, LW T773 LH T774 LS E675, LA E675, LY E675, LS T675 LS T776, LA T776, LO T776, LY T776, LB T776 LHGB T686 LT T68C, LB T68C - Hyper Mini TOPLED® LB M676 - Mini TOPLED Santana® LG M470 LS M47K, LO M47K, LY M47K Source: http://www.osram.convergy.de - LUMILED® LXK2-PW12-R00, LXK2-PW12-S00, LXK2-PW14-U00, LXK2-PW14-V00 LXK2-PM12-R00, LXK2-PM12-S00, LXK2-PM14-U00 LXK2-PE12-Q00, LXK2-PE12-R00, LXK2-PE12-S00, LXK2-PE14-T00, LXK2-PE14-U00 LXK2-PB12-K00, LXK2-PB12-L00, LXK2-PB12-M00, LXK2-PB14-N00, LXK2-PB14-P00, LXK2-PB14-Q00 LXK2-PR12-L00, LXK2-PR12-M00, LXK2-PR14-Q00, LXK2-PR14-R00 LXK2-PD12-Q00, LXK2-PD12-R00, LXK2-PD12-S00 LXK2-PH12-R00, LXK2-PH12-S00 LXK2-PL12-P00, LXK2-PL12-Q00, LXK2-PL12-R00 Source: www.luxeon.com
Q1-Q3 Q6 = crystal:CRYSTAL: CRYSTAL
Q4 Q7 = SparkFun:TRANSISTOR_NPN: Transistor NPN BJT configuration in SOT23 package. MMBT2222 is the common NPN we use. Double check BCE configuration again layout.
Q5 = transistor-npn:BC548*: NPN Transistor
R1-R28 R30-R54 R56 RS = rcl:R-US_: RESISTOR, American symbol
R29 = resistor:R-US_: RESISTOR, American symbol
S3 = SparkFun:SWITCH-MOMENTARY-2
SG1 = SparkFun:BUZZER: Buzzer 12mm Spark Fun Electronics SKU : Comp-Buzzer
SJ1-SJ3 = jumper:SJ: SMD solder JUMPER
U1 = ftdichip-1:VNC1L
U2 = SparkFun:SCP1000_D01: SCP1000 Barometric pressure sensor. Schematic elements and footprint production proven. Spark Fun Electronics SKU : COM-08128
U3 = SparkFun:USD-SOCKET: microSD Socket Push-push type uSD socket. Schematic element and footprint production proven. Spark Fun Electronics SKU : PRT-00127. tDoc lines correctly indicate media card edge positions when inserting (unlocked, locked, depressed).
U4 = SparkFun:ADXL345
U5 = SparkFun:HIH-4030: Humidity Sensor
U$1 = SparkFun:DS1307
U$2 = SparkFun:HMC5843
U$3 = SparkFun:TEMT6000: Ambient Light Sensor Simple light detection sensor. Output varies with light intensity input. Spark Fun Electronics SKU : COM-08348
U$4 = SparkFun:TRIMPOT
U$5 = SparkFun:LYPR540AH
U$6 U$7 = SparkFun:MOSFET-NCHANNEL-SOIC8: N-Channel MOSFET IRF9410 and NDS8434 are common, SOIC-8 parts.
X1 X2 = con-usb-3:USB: USB Connectors USB-B-PTH is fully proven SKU : PRT-00139 USB-miniB is fully proven SKU : PRT-00587 USB-A-PCB is untested. USB-A-H is throughly reviewed, but untested. Spark Fun Electronics SKU : PRT-00437 USB-B-SMT is throughly reviewed, but untested. Needs silkscreen touching up. USB-A-S has not been used/tested USB-MB-H has not been used/tested
X3 X4 = con-molex:22-23-2021: .100" (2.54mm) Center Header - 2 Pin
X6 = SparkFun:USB: USB Connectors USB-B-PTH is fully proven SKU : PRT-00139 USB-miniB is fully proven SKU : PRT-00587 USB-A-PCB is untested. USB-A-H is throughly reviewed, but untested. Spark Fun Electronics SKU : PRT-00437 USB-B-SMT is throughly reviewed, but untested. Needs silkscreen touching up. USB-A-S has not been used/tested USB-MB-H has not been used/tested
XB1 = maxstream:XBEE: XBee (TM) /XBee-PRO(TM) OEM RF Modules Source: MaxStream, Inc. xbee_productmanual.pdf

## Net classes
1 vcc: width 0.203 mm
2 gnd: width 0.305 mm, drill 0.711 mm, clearance 0.203 mm
3 usbvcc: width 0.508 mm, drill 0.711 mm, clearance 0.203 mm

## Board
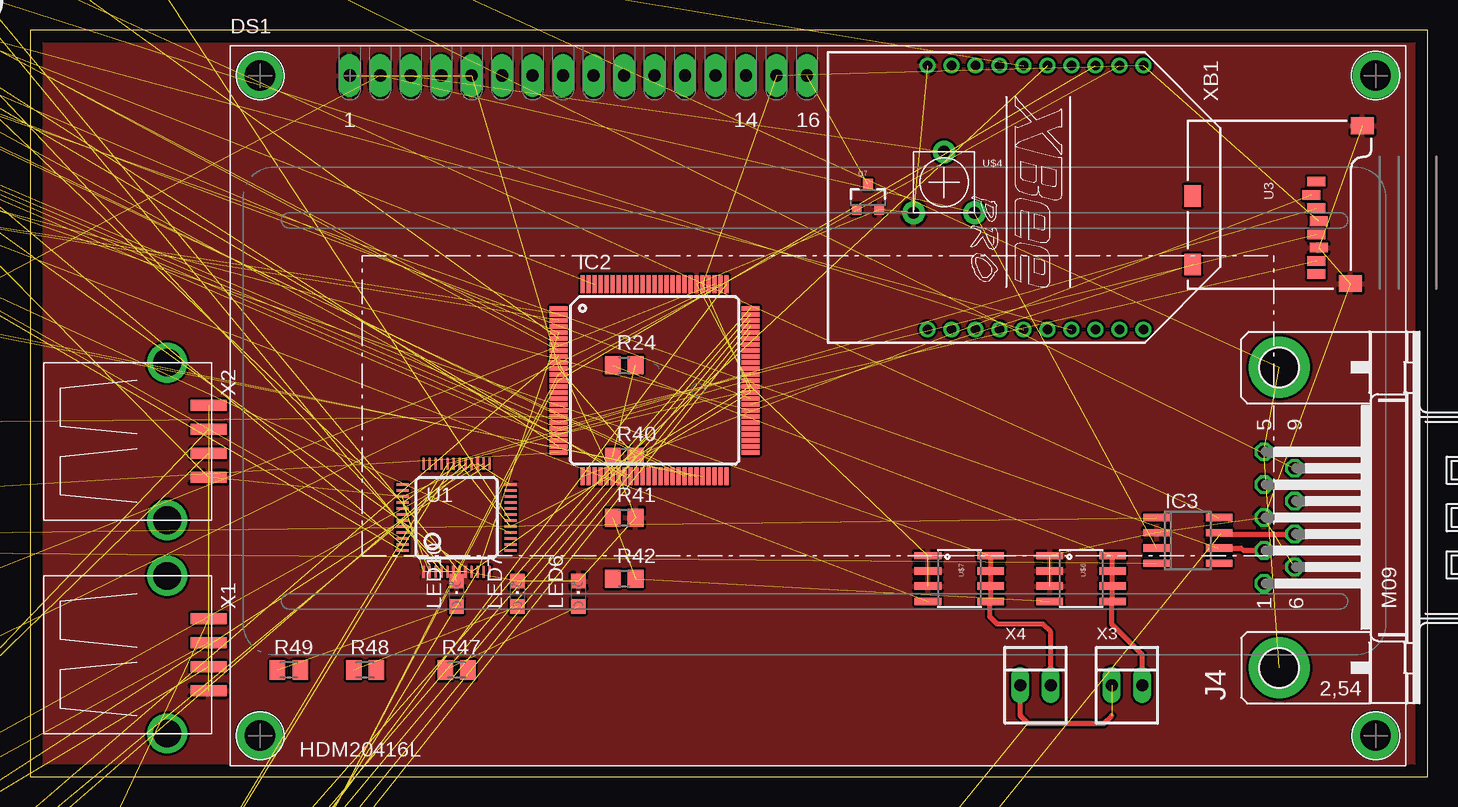
[diagram p5: board, top side]
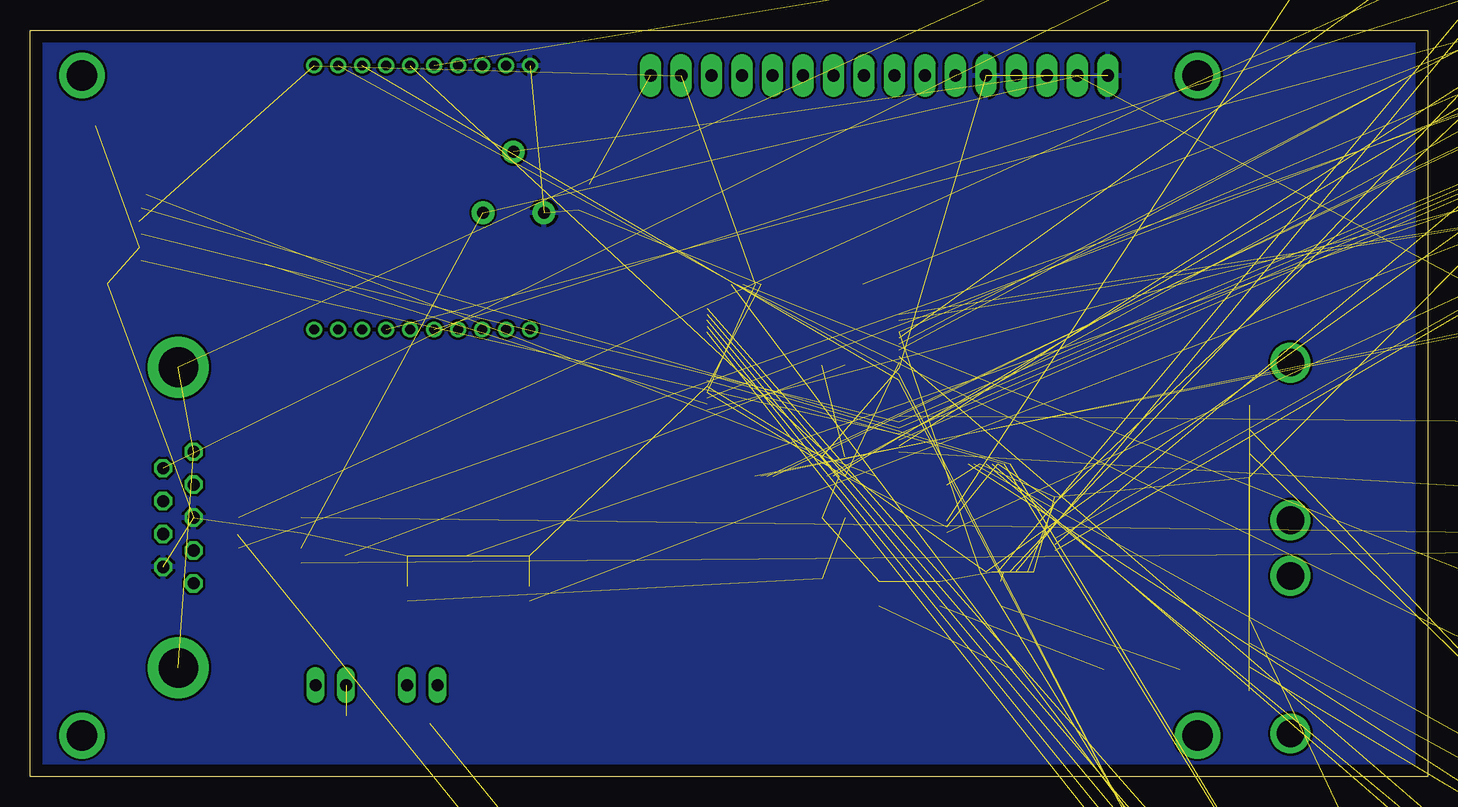
[diagram p6: board, bottom side, seen from below]

Size 116.51 x 62.22 mm. Coordinates in mm from the lower left corner, seen from the top.
Outline: 0,0 116.51,0 116.51,62.22 0,62.22 0,0
Copper layers (1*16): Top 0.035mm / dielectric 1.5mm / Bottom 0.035mm
Design rules "default": minimum track width 10mil, minimum drill 24mil, track to track 8mil, track to pad 8mil, pad to pad 8mil, via to via 8mil, smd to smd 8mil, copper to edge 40mil, drill to drill 8mil, minimum pad ring 10mil, minimum via ring 8mil, stop-mask expansion 4mil, vias tented up to drill 0mil, thermal gap 10mil

### Footprints (pad centres in the part's own frame; a part is rotated, then mirrored left to right if it is on the bottom)
BATTCON_12MM = smd 3.962 x 3.962: GND 0,0 | smd 3.175 x 3.175: PWR@1 -7.874,0; PWR@2 7.874,0
LIPO-1100MAH = drill 1.397 round: + -5,32; - 5,32
C0805 = smd 1.3 x 1.5: 1 -0.95,0; 2 0.95,0
SMC_D = smd 2.4 x 2.8: + -3.15,0; - 3.15,0
C0805K = smd 1.3 x 1.6: 1 -1,0; 2 1,0
SOD123 = smd 1.4 x 1.4: A 1.9,0; C -1.9,0
SOD80C = smd 1.4 x 1.8: A 1.7,0; C -1.7,0
HDM20416L = drill 1.016 pad 1.778 long: 1 -38.105,27.947; 2 -35.565,27.947; 3 -33.025,27.947; 4 -30.485,27.947; 5 -27.945,27.947; 6 -25.405,27.947; 7 -22.865,27.947; 8 -20.325,27.947; 9 -17.785,27.947; 10 -15.245,27.947; 11 -12.705,27.947; 12 -10.165,27.947; 13 -7.625,27.947; 14 -5.085,27.947; 15 -2.545,27.947; 16 -0.005,27.947 | drill 2.54 pad 3.81 round: P$1 47.409,27.94; P$2 47.396,-27.064; P$3 -45.593,-27.064; P$4 -45.593,27.94
L1812 = smd 1.9 x 3.4: 1 -1.95,0; 2 1.95,0
1V60R = drill 1.321 pad 3.15 octagon: + -2.54,-5.08; +@1 -2.54,5.08; - 3.683,0
SO-18W = smd 0.762 x 1.143: 1 -5.08,-4.788; 2 -3.81,-4.788; 3 -2.54,-4.788; 4 -1.27,-4.788; 5 0,-4.788; 6 1.27,-4.788; 7 2.54,-4.788; 8 3.81,-4.788; 9 5.08,-4.788; 10 5.08,4.788; 11 3.81,4.788; 12 2.54,4.788; 13 1.27,4.788; 14 0,4.788; 15 -1.27,4.788; 16 -2.54,4.788; 17 -3.81,4.788; 18 -5.08,4.788
TQFP100 = smd 1.5 x 0.35: 1 -8,6; 2 -8,5.5; 3 -8,5; 4 -8,4.5; 5 -8,4; 6 -8,3.5; 7 -8,3; 8 -8,2.5; 9 -8,2; 10 -8,1.5; 11 -8,1; 12 -8,0.5; 13 -8,0; 14 -8,-0.5; 15 -8,-1; 16 -8,-1.5; 17 -8,-2; 18 -8,-2.5; 19 -8,-3; 20 -8,-3.5; 21 -8,-4; 22 -8,-4.5; 23 -8,-5; 24 -8,-5.5; 25 -8,-6; 51 8,-6; 52 8,-5.5; 53 8,-5; 54 8,-4.5; 55 8,-4; 56 8,-3.5; 57 8,-3; 58 8,-2.5; 59 8,-2; 60 8,-1.5; 61 8,-1; 62 8,-0.5; 63 8,0; 64 8,0.5; 65 8,1; 66 8,1.5; 67 8,2; 68 8,2.5; 69 8,3; 70 8,3.5; 71 8,4; 72 8,4.5; 73 8,5; 74 8,5.5; 75 8,6 | smd 0.35 x 1.5: 26 -6,-8; 27 -5.5,-8; 28 -5,-8; 29 -4.5,-8; 30 -4,-8; 31 -3.5,-8; 32 -3,-8; 33 -2.5,-8; 34 -2,-8; 35 -1.5,-8; 36 -1,-8; 37 -0.5,-8; 38 0,-8; 39 0.5,-8; 40 1,-8; 41 1.5,-8; 42 2,-8; 43 2.5,-8; 44 3,-8; 45 3.5,-8; 46 4,-8; 47 4.5,-8; 48 5,-8; 49 5.5,-8; 50 6,-8; 76 6,8; 77 5.5,8; 78 5,8; 79 4.5,8; 80 4,8; 81 3.5,8; 82 3,8; 83 2.5,8; 84 2,8; 85 1.5,8; 86 1,8; 87 0.5,8; 88 0,8; 89 -0.5,8; 90 -1,8; 91 -1.5,8; 92 -2,8; 93 -2.5,8; 94 -3,8; 95 -3.5,8; 96 -4,8; 97 -4.5,8; 98 -5,8; 99 -5.5,8; 100 -6,8
SO-08 = smd 0.6 x 2.2: 1 -1.905,-2.6; 2 -0.635,-2.6; 3 0.635,-2.6; 4 1.905,-2.6; 5 1.905,2.6; 6 0.635,2.6; 7 -0.635,2.6; 8 -1.905,2.6
TO92- = drill 0.813 octagon: 1 -2.54,0; 2 0,0; 3 2.54,0
SO08 = smd 0.6 x 2.2: 1 -1.905,-2.6; 2 -0.635,-2.6; 3 0.635,-2.6; 4 1.905,-2.6; 5 1.905,2.6; 6 0.635,2.6; 7 -0.635,2.6; 8 -1.905,2.6
SO08WIDE = smd 0.61 x 2.21: 1 -1.905,-3.569; 2 -0.635,-3.569; 3 0.635,-3.569; 4 1.905,-3.569; 5 1.905,3.886; 6 0.635,3.886; 7 -0.635,3.886; 8 -1.905,3.886
SSOP28DB = smd 0.348 x 1.397: 1 -4.225,-3.656; 2 -3.575,-3.656; 3 -2.925,-3.656; 4 -2.275,-3.656; 5 -1.625,-3.656; 6 -0.975,-3.656; 7 -0.325,-3.656; 8 0.325,-3.656; 9 0.975,-3.656; 10 1.625,-3.656; 11 2.275,-3.656; 12 2.925,-3.656; 13 3.575,-3.656; 14 4.225,-3.656; 15 4.225,3.656; 16 3.575,3.656; 17 2.925,3.656; 18 2.275,3.656; 19 1.625,3.656; 20 0.975,3.656; 21 0.325,3.656; 22 -0.325,3.656; 23 -0.975,3.656; 24 -1.625,3.656; 25 -2.275,3.656; 26 -2.925,3.656; 27 -3.575,3.656; 28 -4.225,3.656
SOT23-5L = smd 0.55 x 1.2: 1 -0.95,-1.3; 2 0,-1.3; 3 0.95,-1.3; 4 0.95,1.3; 5 -0.95,1.3
SOIC8 = smd 0.6 x 2.2: 1 -1.905,-2.6; 2 -0.635,-2.6; 3 0.635,-2.6; 4 1.905,-2.6; 5 1.905,2.6; 6 0.635,2.6; 7 -0.635,2.6; 8 -1.905,2.6
SOT223 = smd 1.219 x 2.235: 1 -2.311,-3.099; 2 0,-3.099; 3 2.311,-3.099 | smd 3.6 x 2.2: 4 0,3.099
22-23-2041 = drill 1 long: 1 -3.81,0; 2 -1.27,0; 3 1.27,0; 4 3.81,0
M09HP = drill 1.016 octagon: 1 -5.486,1.27; 2 -2.743,1.27; 3 0,1.27; 4 2.743,1.27; 5 5.486,1.27; 6 -4.115,-1.27; 7 -1.372,-1.27; 8 1.372,-1.27; 9 4.115,-1.27 | drill 3.302 pad 5.08 round: G1 -12.522,0; G2 12.522,0
1X06 = drill 1.016 long: 1 -6.35,0; 2 -3.81,0; 3 -1.27,0; 4 1.27,0; 5 3.81,0; 6 6.35,0
MS50 = smd 2.8 x 1.4: 1 0,-1.7; 2 0,1.7
SM-B5 = smd 2 x 1.7: 1 -2,0; 2 2,0
CHIPLED_0805 = smd 1.2 x 1.2: A 0,-1.05; C 0,1.05
CHIP-LED0805 = smd 1.2 x 1.2: A 0,-1.05; C 0,1.05
TC38H = drill 0.813 round: 1 -1.27,0; 2 1.27,0
HC49/S = drill 0.813 round: 1 -2.413,0; 2 2.413,0
SOT23-3 = smd 0.8 x 0.9: 1 -0.95,-1; 2 0.95,-1; 3 0,1.1
TO92-EBC = drill 0.813 long: B 0,-1.27; C -2.54,-1.27; E 2.54,-1.27
HC49UP = smd 5.334 x 1.93: 1 -4.826,0; 2 4.826,0
R0805 = smd 1.3 x 1.5: 1 -0.95,0; 2 0.95,0
M0805 = smd 1.3 x 1.6: 1 -0.95,0; 2 0.95,0
TACTILE_SWITCH_SMD = smd 1.524 x 0.762: 1 -2.54,1.905; 2 2.54,1.905; 3 -2.54,-1.905; 4 2.54,-1.905
BUZZER-CCV = smd 3.2 x 2.5: + 4,0; - -4,0 | hole 0.8: -3.9,-2.25; 2.25,3.9
SJ = smd 1.168 x 1.6: 1 -0.762,0; 2 0.762,0
LQFP48 = smd 0.2 x 1: 1 -2.75,-4.5; 2 -2.25,-4.5; 3 -1.75,-4.5; 4 -1.25,-4.5; 5 -0.75,-4.5; 6 -0.25,-4.5; 7 0.25,-4.5; 8 0.75,-4.5; 9 1.25,-4.5; 10 1.75,-4.5; 11 2.25,-4.5; 12 2.75,-4.5; 25 2.75,4.5; 26 2.25,4.5; 27 1.75,4.5; 28 1.25,4.5; 29 0.75,4.5; 30 0.25,4.5; 31 -0.25,4.5; 32 -0.75,4.5; 33 -1.25,4.5; 34 -1.75,4.5; 35 -2.25,4.5; 36 -2.75,4.5 | smd 1 x 0.2: 13 4.5,-2.75; 14 4.5,-2.25; 15 4.5,-1.75; 16 4.5,-1.25; 17 4.5,-0.75; 18 4.5,-0.25; 19 4.5,0.25; 20 4.5,0.75; 21 4.5,1.25; 22 4.5,1.75; 23 4.5,2.25; 24 4.5,2.75; 37 -4.5,2.75; 38 -4.5,2.25; 39 -4.5,1.75; 40 -4.5,1.25; 41 -4.5,0.75; 42 -4.5,0.25; 43 -4.5,-0.25; 44 -4.5,-0.75; 45 -4.5,-1.25; 46 -4.5,-1.75; 47 -4.5,-2.25; 48 -4.5,-2.75
SCP1000-LG = smd 0.5 x 2: ATST -2.13,-2.74; AVDD -1.33,2.73; AVSS -2.14,2.73; CLK 0.26,-2.74; CSB -0.54,2.73; DRDY -0.53,-2.74; DVDD 1.06,-2.74; DVSS 1.87,-2.74; MISO 0.26,2.73; MOSI/SDA 1.06,2.73; SCK/SCL 1.87,2.73; TRIG -1.33,-2.74 | smd 1.5 x 0.5: ATST@1 -2.98,-0.8; AVSS@1 -2.99,0.8; DUMMY1 3.08,0; DUMMY2 -2.98,0; DVDDS 3.08,-0.8; PD 3.08,0.8
MICRO-SD-SOCKET-PP = smd 0.8 x 1.5: 1 -8.94,10.7; 2 -7.84,10.3; 3 -6.74,10.7; 4 -5.64,10.9; 5 -4.54,10.7; 6 -3.44,10.9; 7 -2.34,10.7; 8 -1.24,10.7 | smd 1.8 x 1.4: CD1 -2.05,0.4; CD2 -7.75,0.4 | smd 1.4 x 1.9: GND1 -13.6,14.55; GND3 -0.45,13.55
LGA14 = smd 0.5 x 1.2: 1 2,1.1; 2 1.2,1.1; 3 0.4,1.1; 4 -0.4,1.1; 5 -1.2,1.1; 6 -2,1.1; 8 -2,-1.1; 9 -1.2,-1.1; 10 -0.4,-1.1; 11 0.4,-1.1; 12 1.2,-1.1; 13 2,-1.1 | smd 1.2 x 0.5: 7 -2.1,0; 14 2.1,0
HIH-4030 = smd 0.508 x 1.778: 1 -1.27,-5.08; 2 0,-5.08; 3 1.27,-5.08 | smd 2.54 x 2.286: NC 0,5.842
SO08' = smd 0.61 x 2.21: 1 -1.905,-2.616; 2 -0.635,-2.616; 3 0.635,-2.616; 4 1.905,-2.616; 5 1.905,2.616; 6 0.635,2.616; 7 -0.635,2.616; 8 -1.905,2.616
LPCC20 = smd 0.25 x 0.56: 1 1,1.88; 2 0.5,1.88; 3 0,1.88; 4 -0.5,1.88; 5 -1,1.88; 11 -1,-1.88; 12 -0.5,-1.88; 13 0,-1.88; 14 0.5,-1.88; 15 1,-1.88 | smd 0.56 x 0.25: 6 -1.88,1; 7 -1.88,0.5; 8 -1.88,0; 9 -1.88,-0.5; 10 -1.88,-1; 16 1.88,-1; 17 1.88,-0.5; 18 1.88,0; 19 1.88,0.5; 20 1.88,1
TEMT6000-SEN = smd 1.1 x 0.8: BASE -1.87,-0.65; EMITTER -1.87,0.65 | smd 1.1 x 1: COLLECTOR 1.86,0.01
TRIM_POT_PTH = drill 1 pad 1.88 round: 1 -2.54,-2.54; 2 0,2.54; 3 2.54,-2.54
LGA28L = smd 0.4 x 1: 1 2.7,2; 2 2.1,2; 3 1.5,2; 4 0.9,2; 5 0.3,2; 6 -0.3,2; 7 -0.9,2; 8 -1.5,2; 9 -2.1,2; 10 -2.7,2; 15 -2.7,-2; 16 -2.1,-2; 17 -1.5,-2; 18 -0.9,-2; 19 -0.3,-2; 20 0.3,-2; 21 0.9,-2; 22 1.5,-2; 23 2.1,-2; 24 2.7,-2; P$1 -2.7,2; P$2 -2.1,2; P$3 -1.5,2; P$4 -0.9,2; P$5 -0.3,2; P$6 0.3,2; P$7 0.9,2; P$8 1.5,2; P$9 2.1,2; P$10 2.7,2; P$29 2.7,-2; P$30 2.1,-2; P$31 1.5,-2; P$32 0.9,-2; P$33 0.3,-2; P$34 -0.3,-2; P$35 -0.9,-2; P$36 -1.5,-2; P$37 -2.1,-2; P$38 -2.7,-2 | smd 1 x 0.4: 11 -3.55,0.9; 12 -3.55,0.3; 13 -3.55,-0.3; 14 -3.55,-0.9; 25 3.55,-0.9; 26 3.55,-0.3; 27 3.55,0.3; 28 3.55,0.9; P$11 3.55,0.3; P$12 -3.55,0.3; P$13 3.55,0.9; P$14 -3.55,0.9; P$39 -3.55,-0.3; P$40 -3.55,-0.9; P$41 3.55,-0.3; P$42 3.55,-0.9
USB-A-S = smd 3 x 0.9: D+ 3.45,-1; D- 3.45,1; GND 3.45,-3; VBUS 3.45,3 | drill 2.311 round: P$5 0,-6.566; P$6 0,6.566
22-23-2021 = drill 1 long: 1 -1.27,0; 2 1.27,0
USB-MINIB = smd 2.5 x 0.5: D+ 2.5,0; D- 2.5,0.8; GND 2.5,-1.6; ID 2.5,-0.8; VBUS 2.5,1.6 | smd 2.5 x 2: GND@1 -3,-4.5; GND@2 -3,4.5; GND@3 2.5,4.5; GND@4 2.5,-4.5 | hole 0.9: 0,2.2; 0,-2.2
XBEE-PRO = drill 0.8 pad 1.27 round: 1 -11,9; 2 -11,7; 3 -11,5; 4 -11,3; 5 -11,1; 6 -11,-1; 7 -11,-3; 8 -11,-5; 9 -11,-7; 10 -11,-9; 11 11,-9; 12 11,-7; 13 11,-5; 14 11,-3; 15 11,-1; 16 11,1; 17 11,3; 18 11,5; 19 11,7; 20 11,9

### Placement (x,y rotation side)
B1  -21.59,45.72 0 top  (outside the outline)
BAT1  -251.46,-444.5 0 top  (outside the outline)
C1  -43.18,66.04 0 top  (outside the outline)
C2  -48.26,57.15 0 top  (outside the outline)
C3  -3.81,95.25 0 top  (outside the outline)
C4  -8.89,95.25 0 top  (outside the outline)
C5  -13.97,95.25 0 top  (outside the outline)
C6  -50.8,66.04 0 top  (outside the outline)
C7  -19.05,95.25 0 top  (outside the outline)
C8  -24.13,95.25 0 top  (outside the outline)
C9  -58.42,66.04 0 top  (outside the outline)
C10  -90.17,85.09 0 top  (outside the outline)
C11  -127,-71.12 0 top  (outside the outline)
C12  -127,-76.2 0 top  (outside the outline)
C13  -127,-105.41 0 top  (outside the outline)
C14  -120.65,-105.41 0 top  (outside the outline)
C15  -19.05,90.17 0 top  (outside the outline)
C16  -24.13,90.17 0 top  (outside the outline)
C17  -134.62,-132.08 0 top  (outside the outline)
C18  -34.29,90.17 0 top  (outside the outline)
C19  -39.37,90.17 0 top  (outside the outline)
C20  -30.48,86.36 0 top  (outside the outline)
C21  -36.83,86.36 0 top  (outside the outline)
C22  -66.04,66.04 0 top  (outside the outline)
C23  -73.66,66.04 0 top  (outside the outline)
C24  -62.23,73.66 0 top  (outside the outline)
C25  -68.58,73.66 0 top  (outside the outline)
C26  -81.28,66.04 0 top  (outside the outline)
C27  -88.9,66.04 0 top  (outside the outline)
C28  -6.35,73.66 0 top  (outside the outline)
C29  -13.97,73.66 0 top  (outside the outline)
C30  -21.59,73.66 0 top  (outside the outline)
C31  -43.18,86.36 0 top  (outside the outline)
C32  -58.42,57.15 0 top  (outside the outline)
C33  -74.93,73.66 0 top  (outside the outline)
C34  -38.1,57.15 0 top  (outside the outline)
C35  -29.21,73.66 0 top  (outside the outline)
C36  -36.83,73.66 0 top  (outside the outline)
C37  -109.22,-49.53 0 top  (outside the outline)
C38  -134.62,-219.71 0 top  (outside the outline)
C39  -127,-115.57 0 top  (outside the outline)
C40  -134.62,-152.4 0 top  (outside the outline)
C41  -134.62,-157.48 0 top  (outside the outline)
C42  -134.62,-162.56 0 top  (outside the outline)
C43  -134.62,-226.06 0 top  (outside the outline)
C44  -134.62,-232.41 0 top  (outside the outline)
C45  -134.62,-238.76 0 top  (outside the outline)
C46  -134.62,-245.11 0 top  (outside the outline)
C47  -134.62,-251.46 0 top  (outside the outline)
C48  -195.58,-440.69 0 top  (outside the outline)
C49  -198.12,-449.58 0 top  (outside the outline)
C50  -284.48,-534.67 0 top  (outside the outline)
C51  -284.48,-543.56 0 top  (outside the outline)
C52  -284.48,-552.45 0 top  (outside the outline)
C53  -265.43,-474.98 0 top  (outside the outline)
C54  -293.37,-561.34 0 top  (outside the outline)
C55  -293.37,-570.23 0 top  (outside the outline)
D1  -44.45,80.01 0 top  (outside the outline)
D2  -285.75,-518.16 0 top  (outside the outline)
D3  -295.91,-598.17 0 top  (outside the outline)
D4  -285.75,-511.81 0 top  (outside the outline)
D6  -168.91,-331.47 0 top  (outside the outline)
D7  -168.91,-337.82 0 top  (outside the outline)
D9  -168.91,-379.73 0 top  (outside the outline)
D11  -168.91,-386.08 0 top  (outside the outline)
D15  -168.91,-411.48 0 top  (outside the outline)
D16  -168.91,-417.83 0 top  (outside the outline)
D17  -168.91,-425.45 0 top  (outside the outline)
D18  -168.91,-433.07 0 top  (outside the outline)
DS1  64.77,30.48 0 top
F2  -285.75,-504.19 0 top  (outside the outline)
F3  -285.75,-525.78 0 top  (outside the outline)
F4  -306.07,-605.79 0 top  (outside the outline)
G1  -217.17,-462.28 0 top  (outside the outline)
IC1  -78.74,24.13 0 top  (outside the outline)
IC2  52.07,33.02 0 top
IC3  96.52,19.69 270 top
IC4  -7.62,57.15 0 top  (outside the outline)
IC5  -6.35,43.18 0 top  (outside the outline)
IC6  -64.77,24.13 0 top  (outside the outline)
IC7  -106.68,-36.83 0 top  (outside the outline)
IC8  -194.31,-458.47 0 top  (outside the outline)
IC9  -198.12,-467.36 0 top  (outside the outline)
IC10  -228.6,-467.36 0 top  (outside the outline)
IC11  -294.64,-552.45 0 top  (outside the outline)
IC12  -306.07,-614.68 0 top  (outside the outline)
J1  -166.37,-372.11 0 top  (outside the outline)
J3  -46.99,45.72 0 top  (outside the outline)
J4  104.14,21.59 90 top
J5  -130.81,-279.4 0 top  (outside the outline)
JP1  -162.56,-303.53 0 top  (outside the outline)
JP2  -77.47,57.15 0 top  (outside the outline)
L1  -22.86,86.36 0 top  (outside the outline)
L2  -133.35,-297.18 0 top  (outside the outline)
L3  -294.64,-591.82 0 top  (outside the outline)
LED1  -78.74,78.74 0 top  (outside the outline)
LED2  -83.82,78.74 0 top  (outside the outline)
LED3  -88.9,78.74 0 top  (outside the outline)
LED4  -2.54,85.09 0 top  (outside the outline)
LED5  -7.62,85.09 0 top  (outside the outline)
LED6  45.72,15.24 0 top
LED7  40.64,15.24 0 top
LED8  -67.31,78.74 0 top  (outside the outline)
LED9  -73.66,78.74 0 top  (outside the outline)
LED10  35.56,15.24 0 top
LED11  -29.21,64.77 0 top  (outside the outline)
LED12  -270.51,-476.25 0 top  (outside the outline)
LED13  -275.59,-490.22 0 top  (outside the outline)
LED14  -280.67,-490.22 0 top  (outside the outline)
LED15  -285.75,-490.22 0 top  (outside the outline)
Q1  -35.56,40.64 0 top  (outside the outline)
Q2  -7.62,64.77 0 top  (outside the outline)
Q3  -20.32,64.77 0 top  (outside the outline)
Q4  -100.33,-26.67 0 top  (outside the outline)
Q5  -16.51,58.42 0 top  (outside the outline)
Q6  -82.55,44.45 0 top  (outside the outline)
Q7  69.85,48.26 0 top
R1  -49.53,90.17 0 top  (outside the outline)
R2  -127,-81.28 0 top  (outside the outline)
R3  -114.3,-105.41 0 top  (outside the outline)
R4  -127,-110.49 0 top  (outside the outline)
R5  -134.62,-127 0 top  (outside the outline)
R6  -74.93,90.17 0 top  (outside the outline)
R7  -80.01,90.17 0 top  (outside the outline)
R8  -85.09,90.17 0 top  (outside the outline)
R9  -90.17,90.17 0 top  (outside the outline)
R10  -48.26,85.09 0 top  (outside the outline)
R11  -85.09,85.09 0 top  (outside the outline)
R12  -54.61,85.09 0 top  (outside the outline)
R13  -60.96,85.09 0 top  (outside the outline)
R14  -67.31,85.09 0 top  (outside the outline)
R15  -73.66,85.09 0 top  (outside the outline)
R16  -80.01,85.09 0 top  (outside the outline)
R17  -109.22,-44.45 0 top  (outside the outline)
R18  -127,-66.04 0 top  (outside the outline)
R19  -134.62,-142.24 0 top  (outside the outline)
R20  -81.28,73.66 0 top  (outside the outline)
R21  -87.63,73.66 0 top  (outside the outline)
R22  -43.18,73.66 0 top  (outside the outline)
R23  -49.53,73.66 0 top  (outside the outline)
R24  49.53,34.29 0 top
R25  -15.24,80.01 0 top  (outside the outline)
R26  -20.32,80.01 0 top  (outside the outline)
R27  -55.88,73.66 0 top  (outside the outline)
R28  -5.08,80.01 0 top  (outside the outline)
R29  -60.96,80.01 0 top  (outside the outline)
R30  -134.62,-147.32 0 top  (outside the outline)
R31  -134.62,-187.96 0 top  (outside the outline)
R32  -134.62,-194.31 0 top  (outside the outline)
R33  -134.62,-181.61 0 top  (outside the outline)
R34  -134.62,-200.66 0 top  (outside the outline)
R35  -134.62,-207.01 0 top  (outside the outline)
R36  -134.62,-213.36 0 top  (outside the outline)
R37  -134.62,-257.81 0 top  (outside the outline)
R38  -134.62,-264.16 0 top  (outside the outline)
R39  -134.62,-270.51 0 top  (outside the outline)
R40  49.53,26.67 0 top
R41  49.53,21.59 0 top
R42  49.53,16.51 0 top
R43  -198.12,115.57 0 top  (outside the outline)
R44  -198.12,123.19 0 top  (outside the outline)
R45  -190.5,123.19 0 top  (outside the outline)
R46  -189.23,115.57 0 top  (outside the outline)
R47  35.56,8.89 0 top
R48  27.94,8.89 0 top
R49  21.59,8.89 0 top
R50  -270.51,-482.6 0 top  (outside the outline)
R51  -270.51,-488.95 0 top  (outside the outline)
R52  -285.75,-496.57 0 top  (outside the outline)
R53  -295.91,-579.12 0 top  (outside the outline)
R54  -295.91,-585.47 0 top  (outside the outline)
R56  -25.4,80.01 0 top  (outside the outline)
RS  -30.48,80.01 0 top  (outside the outline)
S3  -107.95,-54.61 0 top  (outside the outline)
SG1  -95.25,-34.29 0 top  (outside the outline)
SJ1  -168.91,-309.88 0 top  (outside the outline)
SJ2  -29.21,95.25 0 top  (outside the outline)
SJ3  -34.29,95.25 0 top  (outside the outline)
U1  35.56,21.59 0 top
U2  -29.21,57.15 0 top  (outside the outline)
U3  96.52,40.64 270 top
U4  -35.56,80.01 0 top  (outside the outline)
U5  -95.25,-11.43 0 top  (outside the outline)
U$1  DS1307  [SO08']  -66.04,57.15 0 top  (outside the outline)
U$2  -35.56,66.04 0 top  (outside the outline)
U$3  -93.98,-20.32 0 top  (outside the outline)
U$4  76.2,49.53 0 top
U$5  -132.08,-120.65 0 top  (outside the outline)
U$6  IRF9410  [SO08']  87.63,16.51 270 top
U$7  IRF9410  [SO08']  77.47,16.51 270 top
X1  11.43,10.16 0 top
X2  11.43,27.94 0 top
X3  91.44,7.62 0 top
X4  83.82,7.62 0 top
X6  -303.53,-595.63 0 top  (outside the outline)
XB1  83.82,48.26 270 top

### Tracks (layer width: path | path; a pad name or v marks a point on that pad's centre or on a via)
1WIRE  (2 unrouted)
+3V3  (66 unrouted)
+5V  (15 unrouted)
+12V  (3 unrouted)
/ACCEL_CS  (1 unrouted)
/BARO_CS  (1 unrouted)
/CAN_CS  (1 unrouted)
/FLASH_CS  (1 unrouted)
/RESET  (10 unrouted)
/SDCARD_CS  (1 unrouted)
/VNC_PROG  (3 unrouted)
ACCEL_INT1  (1 unrouted)
ACCEL_INT2  (1 unrouted)
CAN_INTERRUPT  (2 unrouted)
CD  (1 unrouted)
DRDY  (1 unrouted)
GND  (145 unrouted)
  pour Bottom: -1.27,66.04 127,66.04 127,-5.08 -1.27,-5.08
  pour Top: -1.27,63.5 118.11,63.5 118.11,-1.27 -1.27,-1.27
GPS_RX  (1 unrouted)
GPS_TX  (1 unrouted)
GYRO_4XX  (2 unrouted)
GYRO_4XY  (2 unrouted)
GYRO_4XZ  (2 unrouted)
GYRO_ST  (2 unrouted)
GYRO_X  (2 unrouted)
GYRO_Y  (2 unrouted)
GYRO_Z  (2 unrouted)
H_OUT  (2 unrouted)
LIGHT_OUT  (2 unrouted)
MISO  (5 unrouted)
MOSI  (5 unrouted)
N$2  (2 unrouted)
N$3  (1 unrouted)
N$4  (2 unrouted)
N$5  (2 unrouted)
N$6  (1 unrouted)
N$7  (2 unrouted)
N$8  (2 unrouted)
N$10  (2 unrouted)
N$13  (1 unrouted)
N$14  (2 unrouted)
N$15  (1 unrouted)
N$16  (1 unrouted)
N$17  (1 unrouted)
N$18  (2 unrouted)
N$19  (2 unrouted)
N$20  (1 unrouted)
N$21  (1 unrouted)
N$22  (1 unrouted)
N$23  (1 unrouted)
N$24  (1 unrouted)
N$25  (1 unrouted)
N$26  (1 unrouted)
N$27  (1 unrouted)
N$28  (1 unrouted)
N$29  (1 unrouted)
N$30  (1 unrouted)
N$31  (1 unrouted)
N$32  (1 unrouted)
N$33  (1 unrouted)
N$34  (1 unrouted)
N$35  (1 unrouted)
N$36  (1 unrouted)
N$37  (1 unrouted)
N$38  (1 unrouted)
N$39  (1 unrouted)
N$40  (1 unrouted)
N$43  (2 unrouted)
N$44  (2 unrouted)
N$45  (2 unrouted)
N$46  (1 unrouted)
N$47  (1 unrouted)
N$48  (1 unrouted)
N$49  (1 unrouted)
N$50  (1 unrouted)
N$51  (1 unrouted)
N$52  (1 unrouted)
N$53  (2 unrouted)
N$55  (1 unrouted)
N$59  (1 unrouted)
N$77  (1 unrouted)
N$78  (1 unrouted)
N$85  (2 unrouted)
N$86  (1 unrouted)
N$87  (2 unrouted)
N$88  (2 unrouted)
N$89  (1 unrouted)
N$90  (1 unrouted)
N$91  (1 unrouted)
N$92  (1 unrouted)
N$93  (1 unrouted)
N$94  (1 unrouted)
  Top 0.406: J4.7 99.22,20.22 IC3.7
N$95  (1 unrouted)
  Top 0.406: J4.2 101.17,18.85 100.97,19.05 IC3.6
N$98  (1 unrouted)
N$99  (3 unrouted)
N$100  (1 unrouted)
N$101  (3 unrouted)
N$104  (1 unrouted)
N$111  (1 unrouted)
N$123  (1 unrouted)
N$125  (2 unrouted)
N$126  (1 unrouted)
  Top 0.406: X4.2 85.09,12.06 84.46,12.7 80.65,12.7 80.01,13.33 80.01,14.53 U$7.5 U$7.6 U$7.7 U$7.8
N$127  (1 unrouted)
N$128  (3 unrouted)
N$129  (2 unrouted)
N$130  (1 unrouted)
  Top 0.406: X3.2 92.71,10.16 90.17,12.7 90.17,14.53 U$6.5 U$6.6 U$6.7 U$6.8
N$132  (2 unrouted)
N$133  (1 unrouted)
N$134  (1 unrouted)
N$135  (1 unrouted)
N$136  (1 unrouted)
N$137  (1 unrouted)
N$140  (1 unrouted)
N$141  (1 unrouted)
N$142  (1 unrouted)
N$143  (1 unrouted)
N$144  (2 unrouted)
N$146  (2 unrouted)
N$149  (1 unrouted)
N$150  (1 unrouted)
N$151  (1 unrouted)
N$152  (1 unrouted)
N$154  (1 unrouted)
N$155  (1 unrouted)
N$157  (2 unrouted)
N$158  (2 unrouted)
PYRO1_SENSE  (1 unrouted)
PYRO2_SENSE  (1 unrouted)
RADIO_RX  (3 unrouted)
RADIO_TX  (3 unrouted)
RXD  (3 unrouted)
SCK  (5 unrouted)
SCL  (5 unrouted)
SDA  (5 unrouted)
TXD  (3 unrouted)
V_BATT  (9 unrouted)
  Top 0.406: X4.1 82.55,5.08 83.19,4.45 89.53,4.45 90.17,5.08
V_USB  (1 unrouted)
VINCULUM_RX  (2 unrouted)
VINCULUM_TX  (2 unrouted)